# EAGLE design classix (EAGLE 6.1)

## Sheet 1 of 2
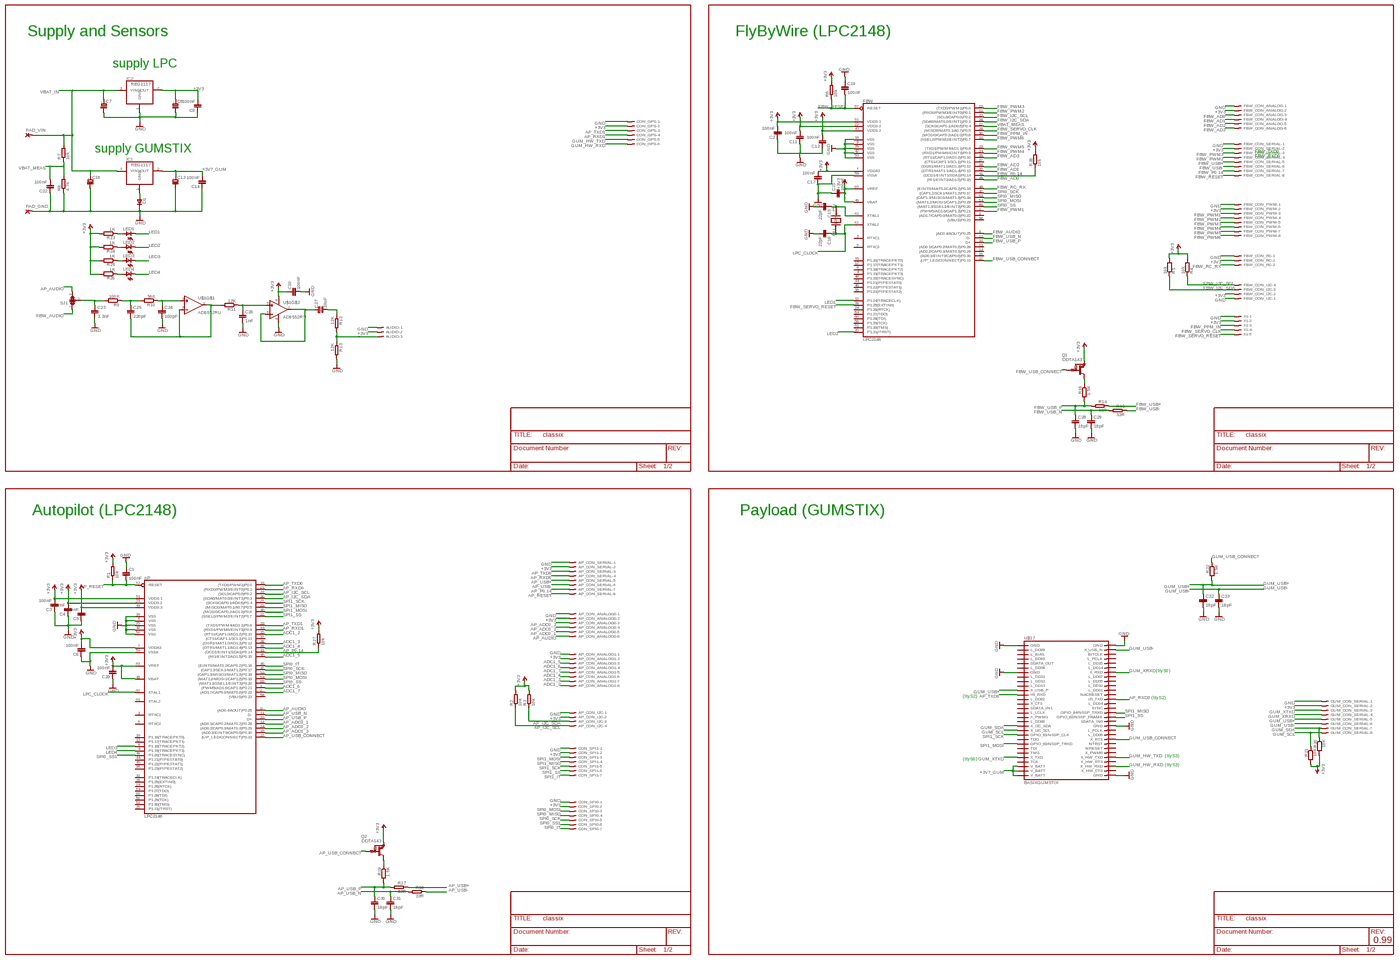
[diagram p0: schematic, sheet 1, overview]
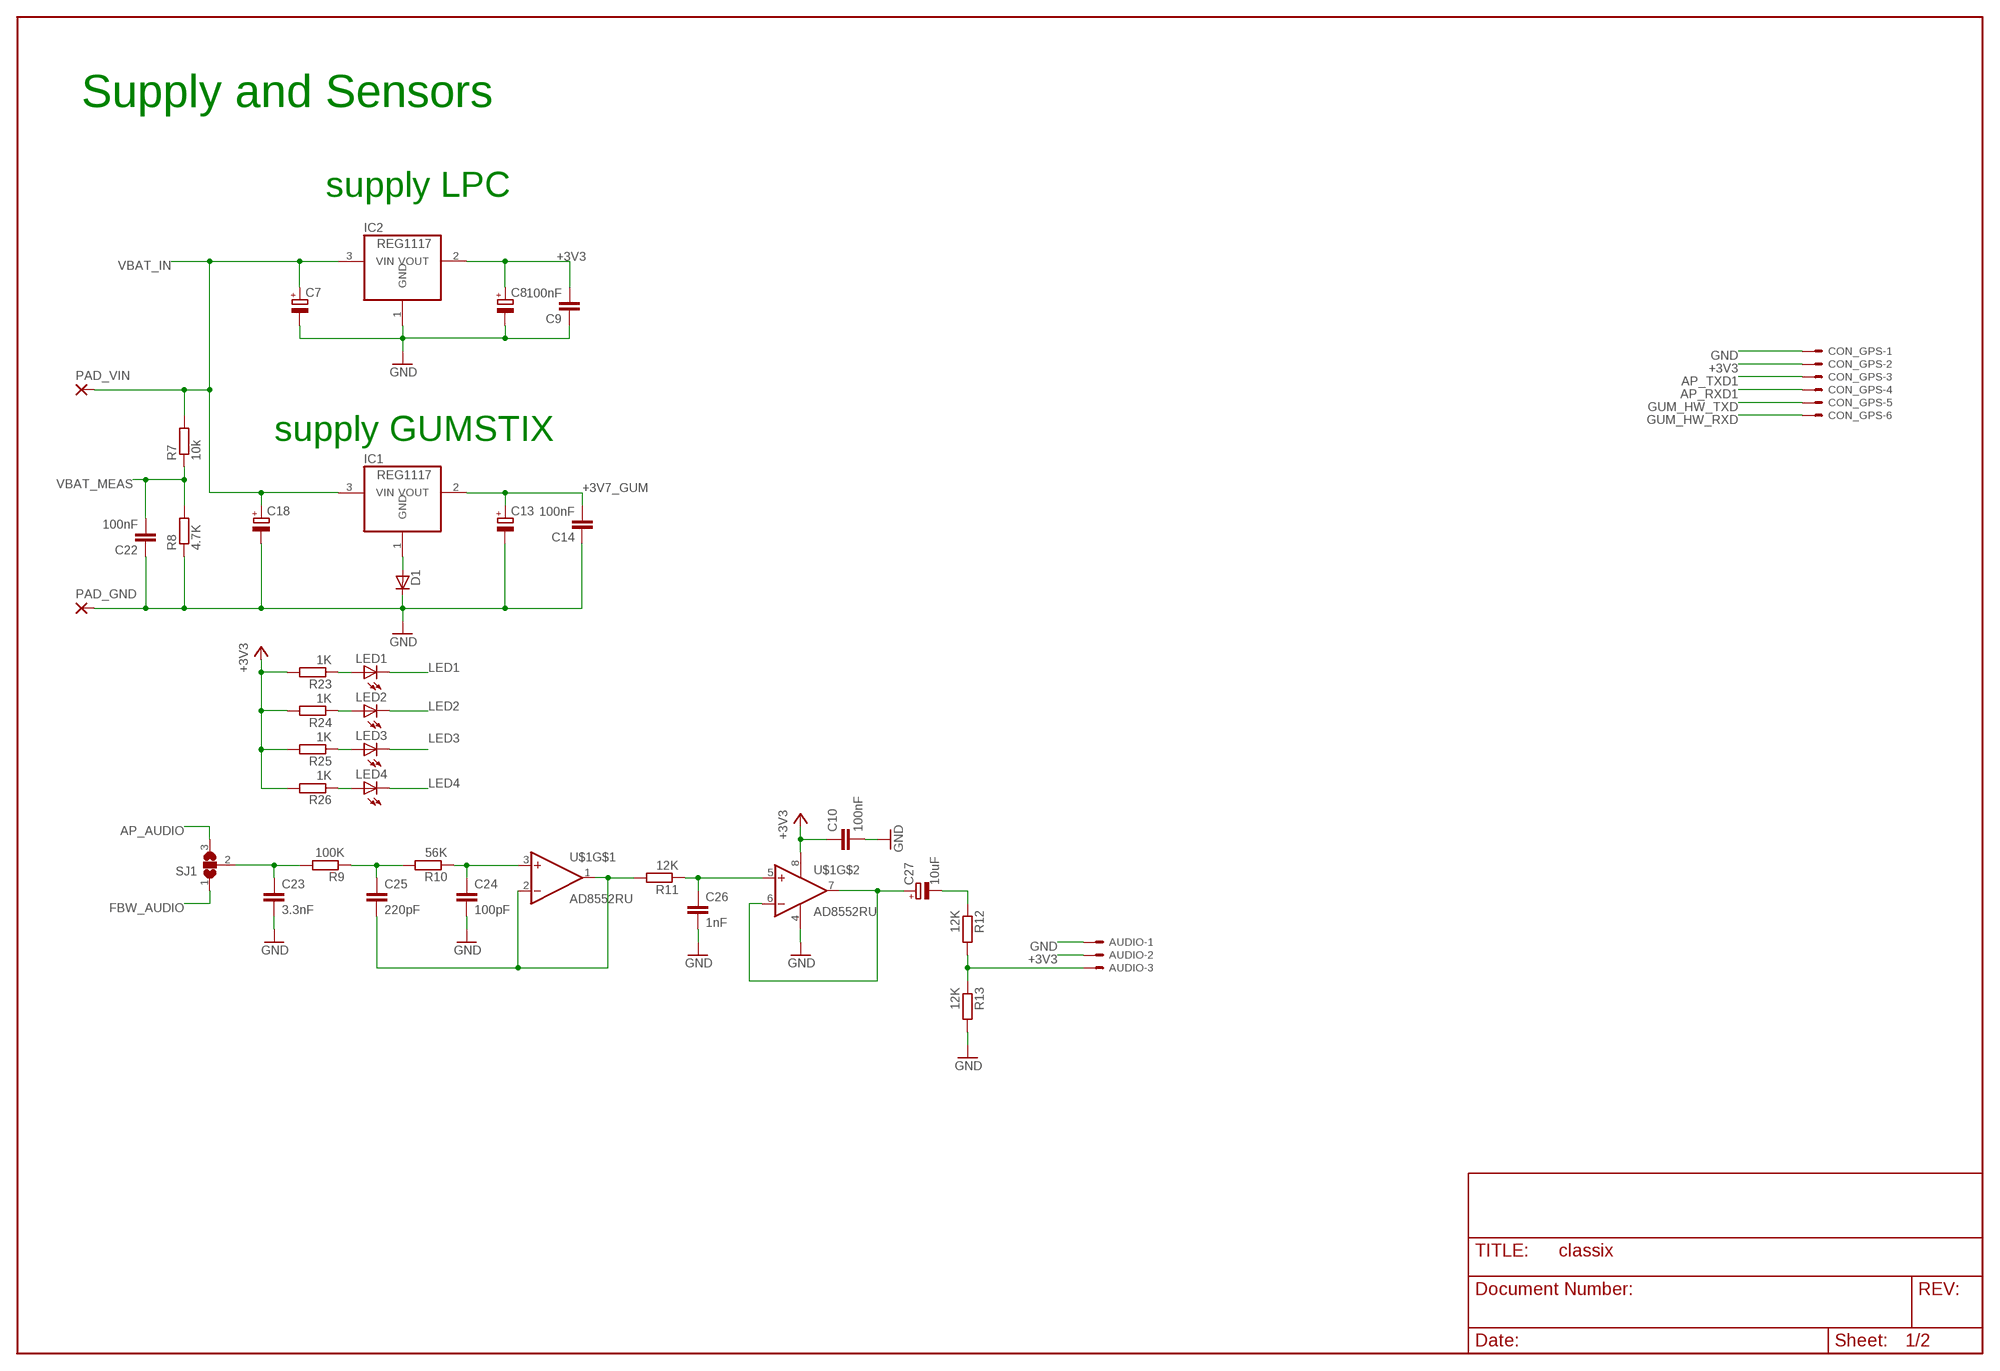
[diagram p1: schematic, sheet 1, part 1 of 4]
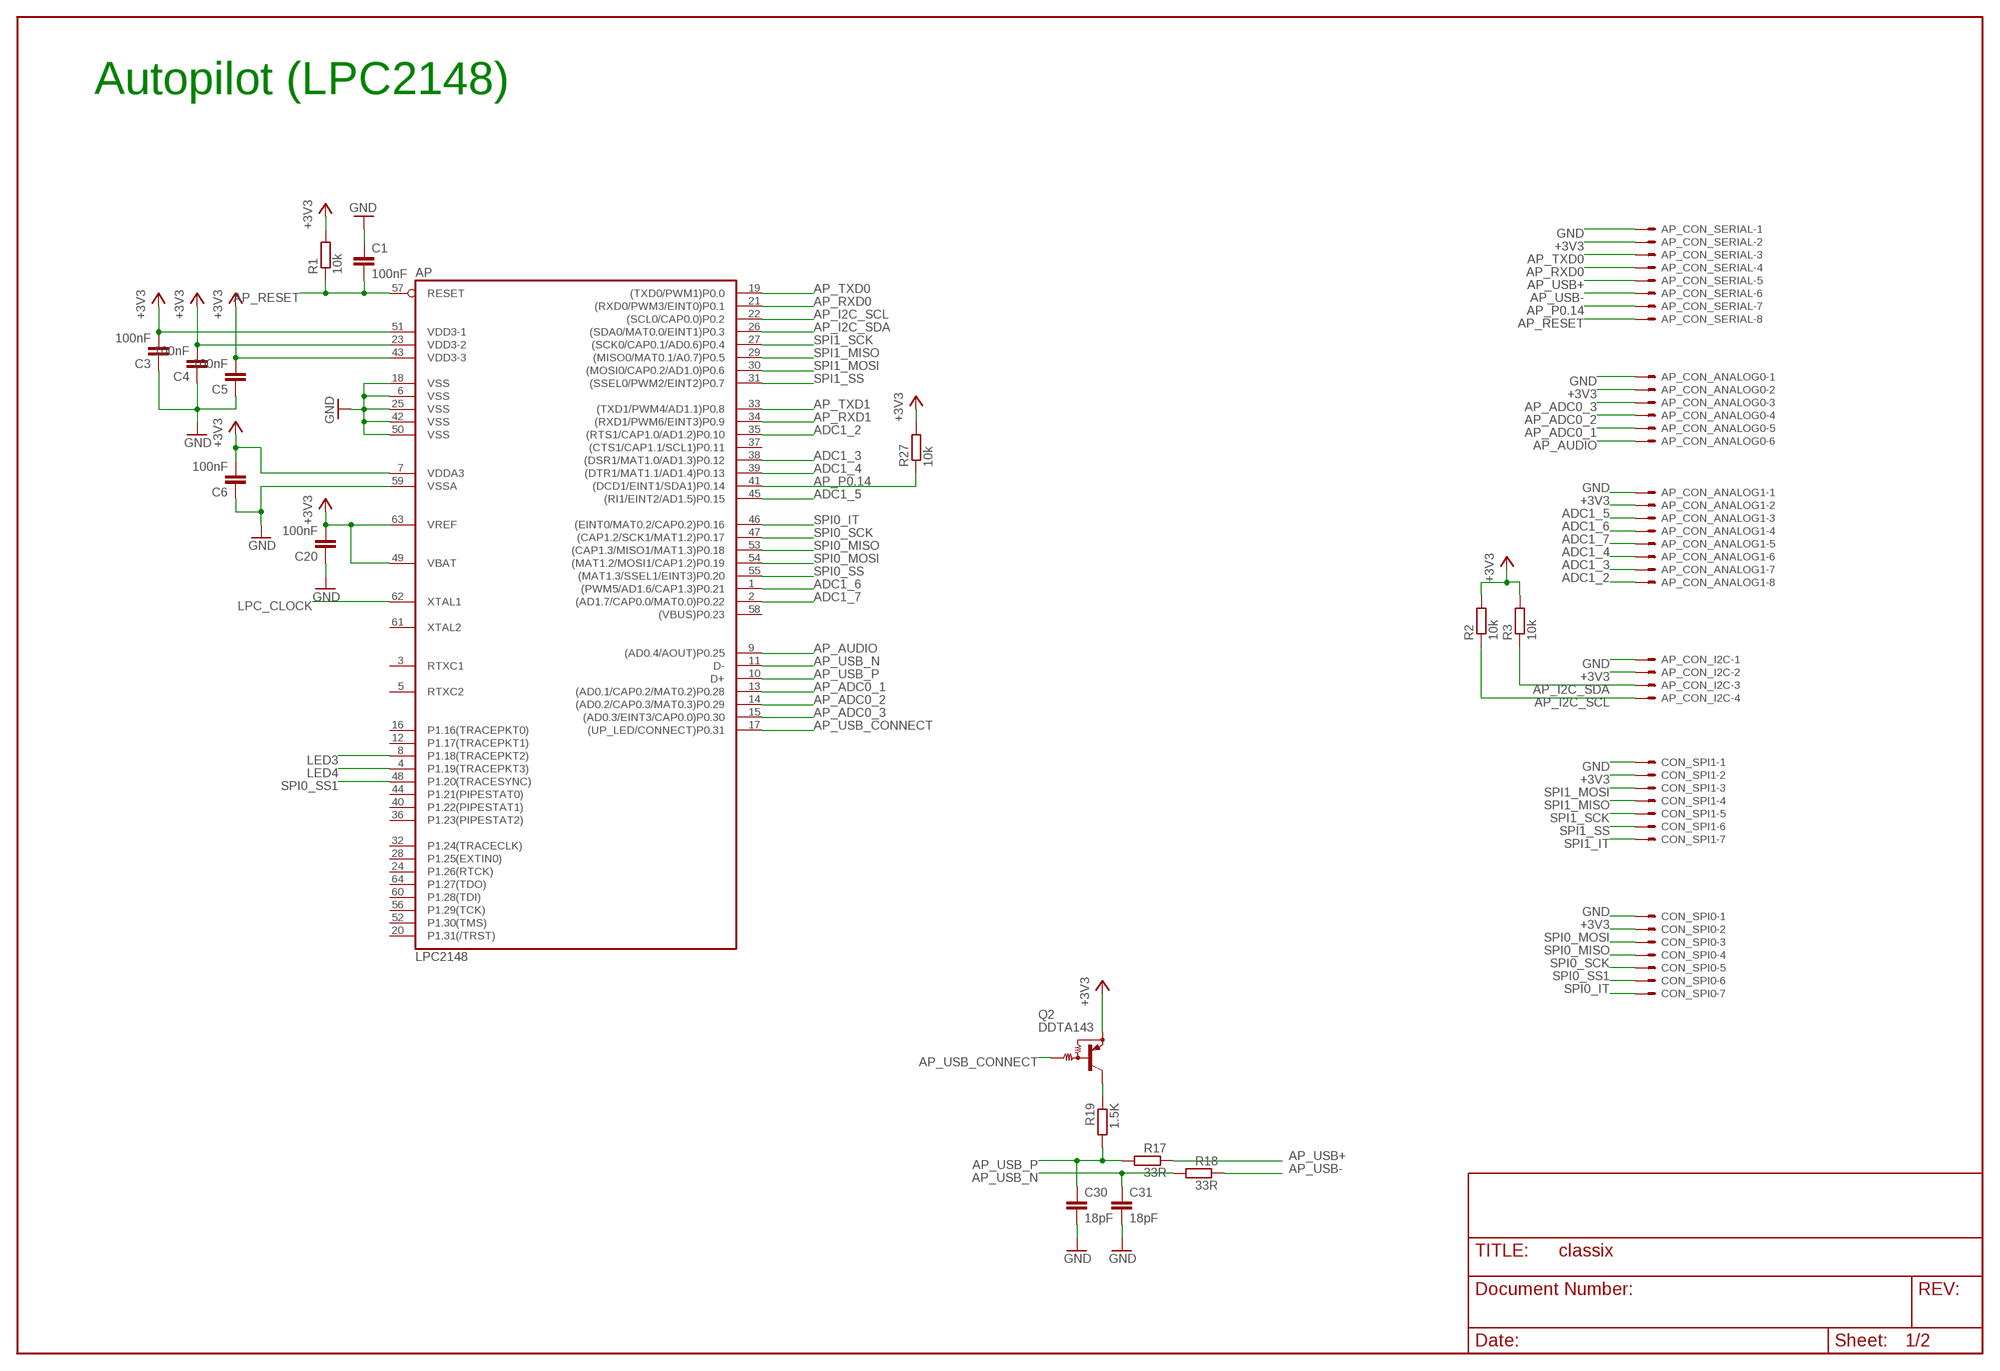
[diagram p2: schematic, sheet 1, part 2 of 4]
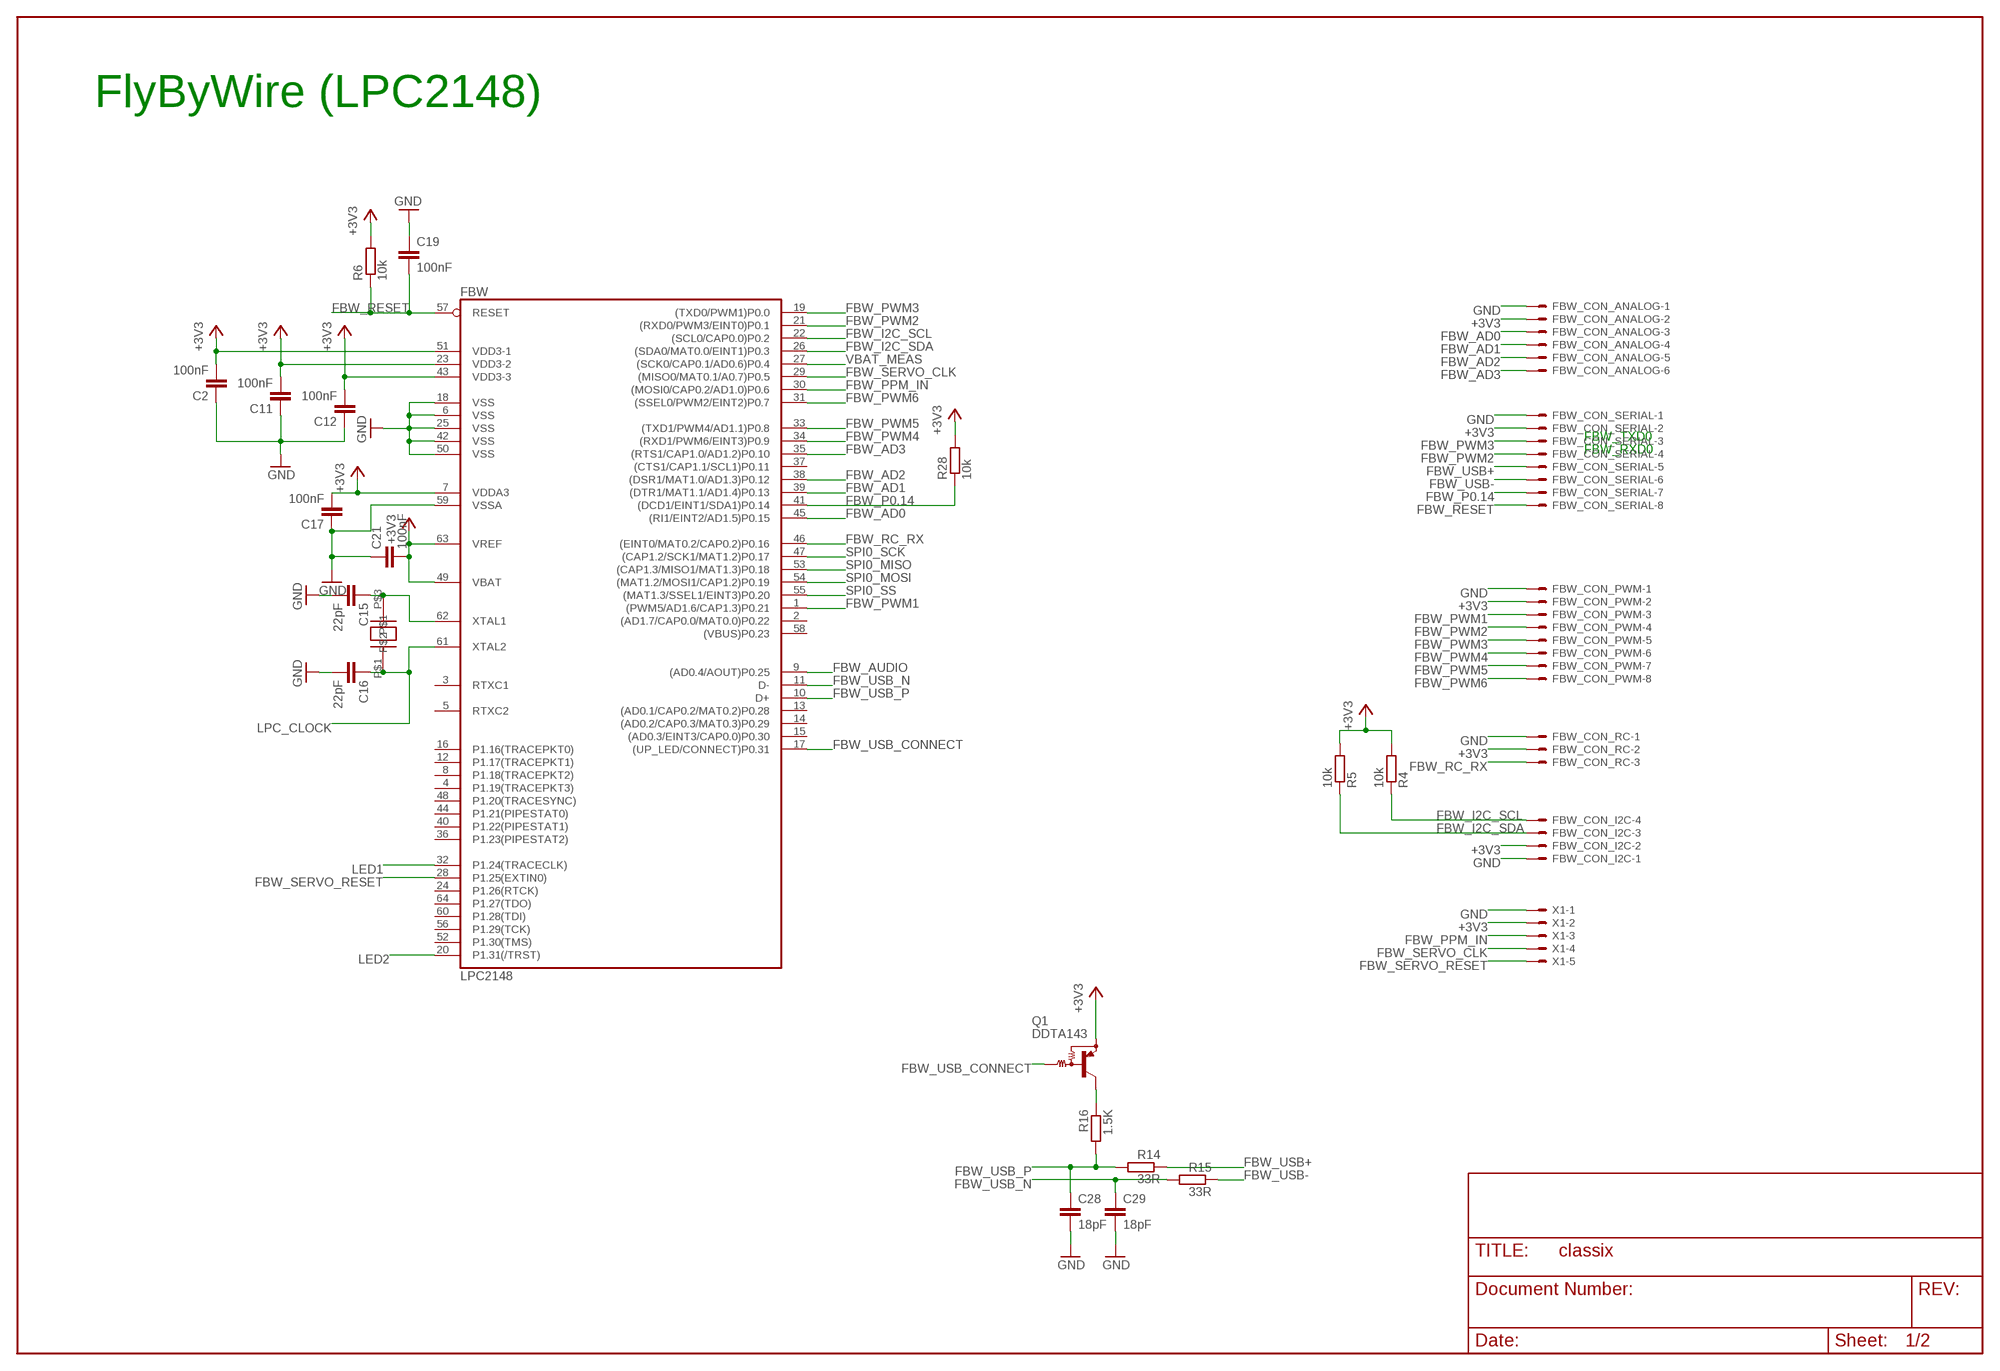
[diagram p3: schematic, sheet 1, part 3 of 4]
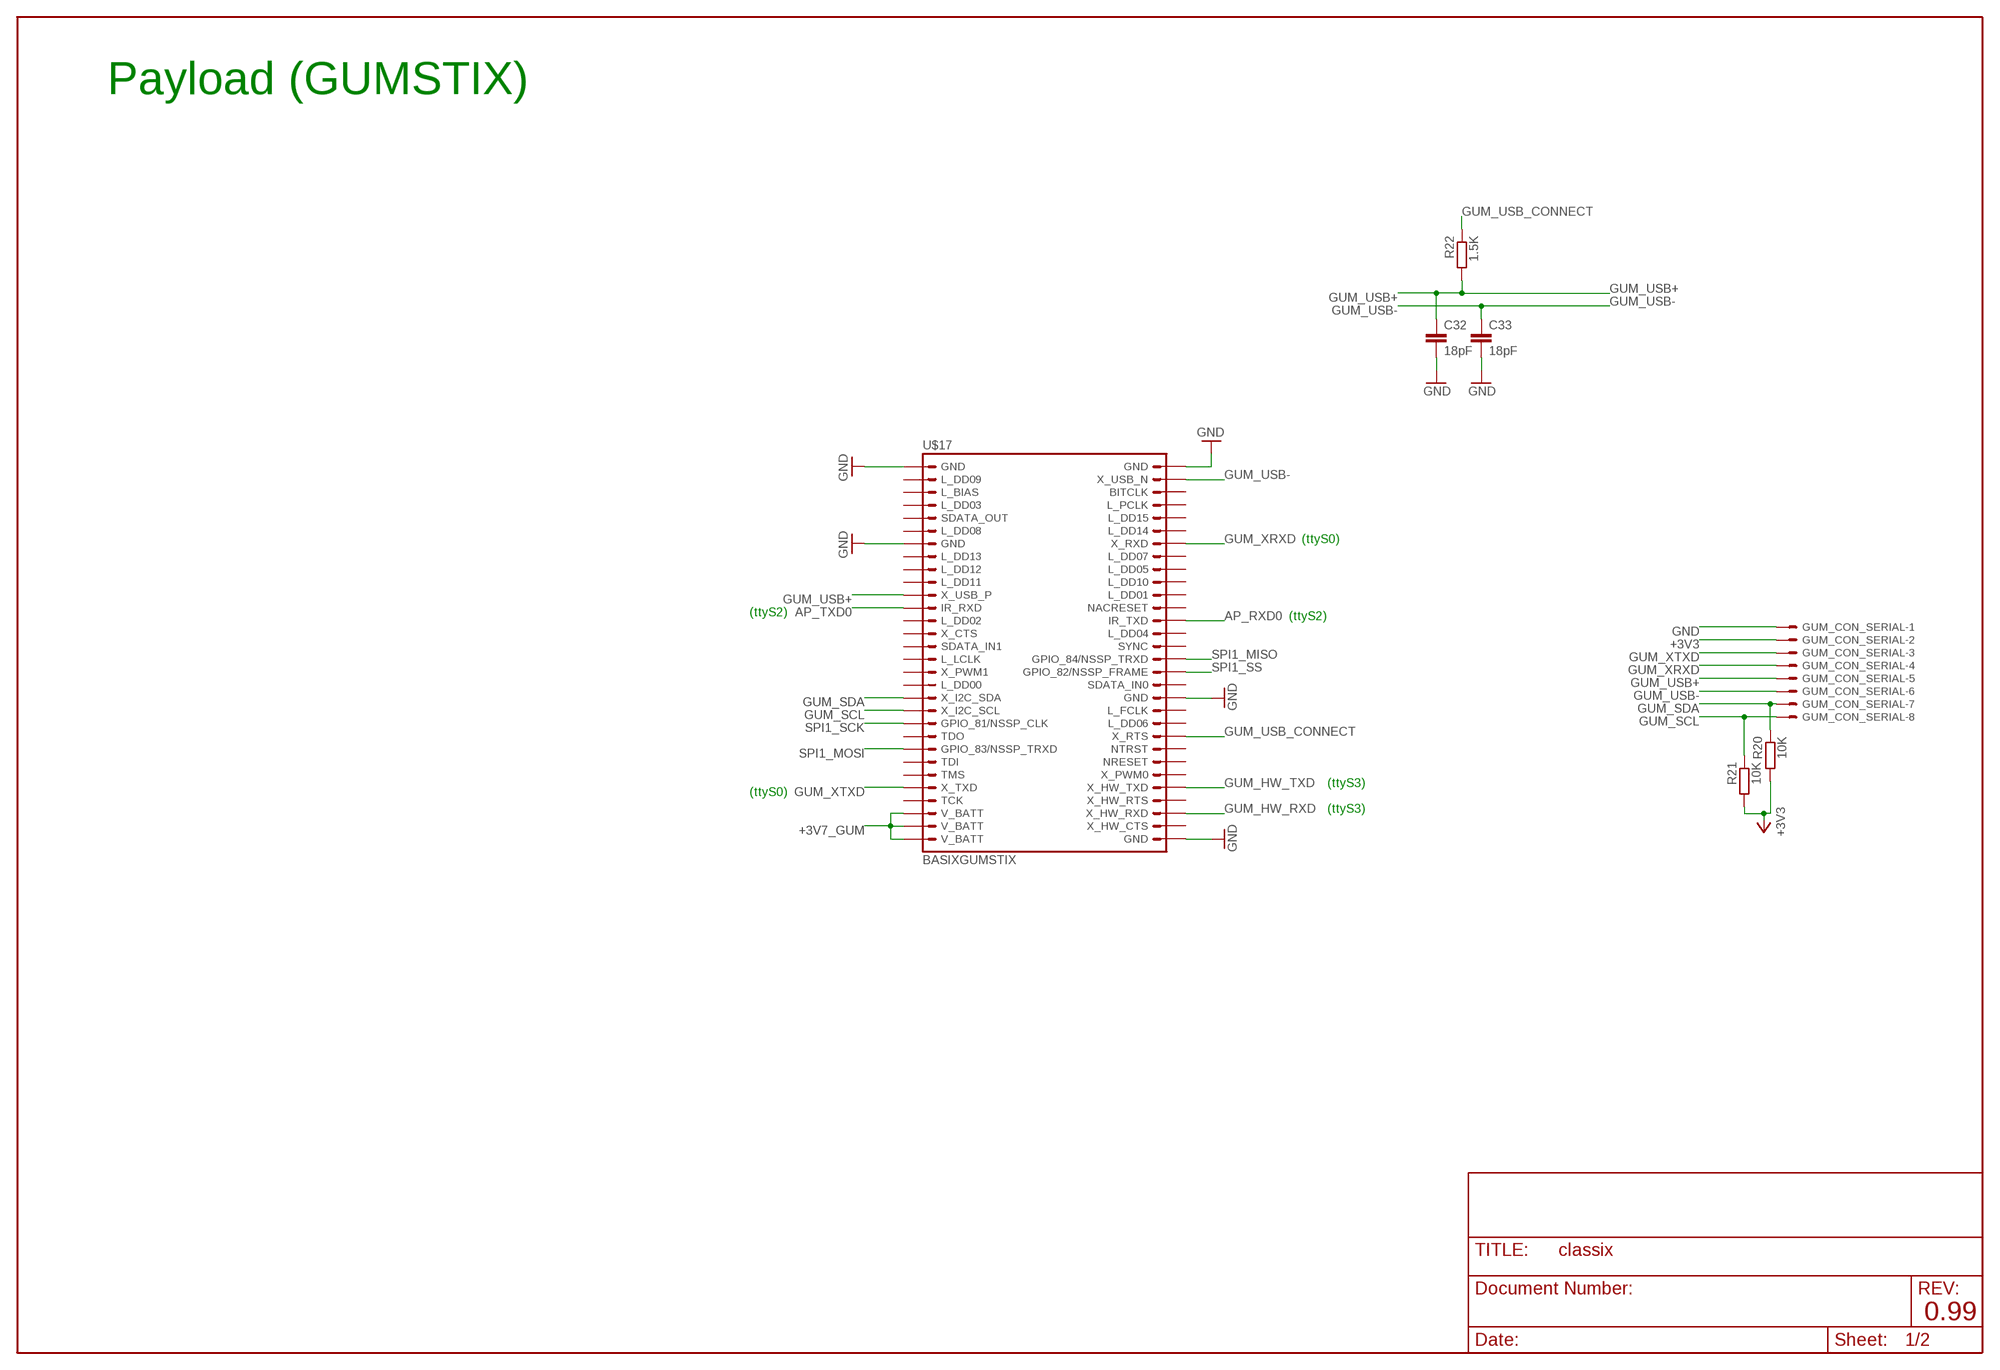
[diagram p4: schematic, sheet 1, part 4 of 4]

### Parts
AP  LPC2148  [SQFP-S-10X10-64]
AP_CON_ANALOG0  53047-06  [53047-06]
AP_CON_ANALOG1  53047-08  [53047-08]
AP_CON_I2C  53047-04  [53047-04]
AP_CON_SERIAL  53047-08  [53047-08]
AUDIO  53047-03  [53047-03]
C1  100nF  C-EUC0603  [C0603]
C2  100nF  C-EUC0603  [C0603]
C3  100nF  C-EUC0603  [C0603]
C4  100nF  C-EUC0603  [C0603]
C5  100nF  C-EUC0603  [C0603]
C6  100nF  C-EUC0603  [C0603]
C7  CPOL-EUA/3216-18R  [A/3216-18R]
C8  CPOL-EUB/3528-21R  [B/3528-21R]
C9  100nF  C-EUC0603  [C0603]
C10  100nF  C-EUC0603  [C0603]
C11  100nF  C-EUC0603  [C0603]
C12  100nF  C-EUC0603  [C0603]
C13  CPOL-EUB/3528-21R  [B/3528-21R]
C14  100nF  C-EUC0603  [C0603]
C15  22pF  C-EUC0603  [C0603]
C16  22pF  C-EUC0603  [C0603]
C17  100nF  C-EUC0603  [C0603]
C18  CPOL-EUA/3216-18R  [A/3216-18R]
C19  100nF  C-EUC0603  [C0603]
C20  100nF  C-EUC0603  [C0603]
C21  100nF  C-EUC0603  [C0603]
C22  100nF  C-EUC0603  [C0603]
C23  3.3nF  C-EUC0603  [C0603]
C24  100pF  C-EUC0603  [C0603]
C25  220pF  C-EUC0603  [C0603]
C26  1nF  C-EUC0603  [C0603]
C27  10uF  CPOL-EUA/3216-18R  [A/3216-18R]
C28  18pF  C-EUC0603  [C0603]
C29  18pF  C-EUC0603  [C0603]
C30  18pF  C-EUC0603  [C0603]
C31  18pF  C-EUC0603  [C0603]
C32  18pF  C-EUC0603  [C0603]
C33  18pF  C-EUC0603  [C0603]
CON_GPS  53047-06  [53047-06]
CON_SPI0  53047-07  [53047-07]
CON_SPI1  53047-07  [53047-07]
D1  D-SOD-80  [SOD80]
FBW  LPC2148  [SQFP-S-10X10-64]
FBW_CON_ANALOG  53047-06  [53047-06]
FBW_CON_I2C  53047-04  [53047-04]
FBW_CON_PWM  53047-08  [53047-08]
FBW_CON_RC  53047-03  [53047-03]
FBW_CON_SERIAL  53047-08  [53047-08]
GUM_CON_SERIAL  53047-08  [53047-08]
IC1  REG1117  [SOT223]
IC2  REG1117  [SOT223]
LED1  LEDCHIP-LED0805  [CHIP-LED0805]
LED2  LEDCHIP-LED0805  [CHIP-LED0805]
LED3  LEDCHIP-LED0805  [CHIP-LED0805]
LED4  LEDCHIP-LED0805  [CHIP-LED0805]
PAD_GND  SMD5  [SMD5]
PAD_VIN  SMD5  [SMD5]
Q1  DDTA143  MUN2111T1  [SC59-BEC]
Q2  DDTA143  MUN2111T1  [SC59-BEC]
R1  10k  R-EU_R0603  [R0603]
R2  10k  R-EU_R0603  [R0603]
R3  10k  R-EU_R0603  [R0603]
R4  10k  R-EU_R0603  [R0603]
R5  10k  R-EU_R0603  [R0603]
R6  10k  R-EU_R0603  [R0603]
R7  10k  R-EU_R0603  [R0603]
R8  4.7K  R-EU_R0603  [R0603]
R9  100K  R-EU_R0603  [R0603]
R10  56K  R-EU_R0603  [R0603]
R11  12K  R-EU_R0603  [R0603]
R12  12K  R-EU_R0603  [R0603]
R13  12K  R-EU_R0603  [R0603]
R14  33R  R-EU_R0603  [R0603]
R15  33R  R-EU_R0603  [R0603]
R16  1.5K  R-EU_R0603  [R0603]
R17  33R  R-EU_R0603  [R0603]
R18  33R  R-EU_R0603  [R0603]
R19  1.5K  R-EU_R0603  [R0603]
R20  10K  R-EU_R0603  [R0603]
R21  10K  R-EU_R0603  [R0603]
R22  1.5K  R-EU_R0603  [R0603]
R23  1K  R-EU_R0603  [R0603]
R24  1K  R-EU_R0603  [R0603]
R25  1K  R-EU_R0603  [R0603]
R26  1K  R-EU_R0603  [R0603]
R27  10k  R-EU_R0603  [R0603]
R28  10k  R-EU_R0603  [R0603]
SJ1  SJ2W  [SJ_2]
U$1  AD8552RU  [TSSOP8]
U$17  BASIXGUMSTIX  [GUMDF12]
U$20  CRYSTAL_CTS  [CTS_CRYSTAL]
X1  53047-05  [53047-05]

### Nets
+3V3: AP.7(VDDA3) AP.23(VDD3-2) AP.43(VDD3-3) AP.49(VBAT) AP.51(VDD3-1) AP.63(VREF) AP_CON_ANALOG0.2 AP_CON_ANALOG1.2 AP_CON_I2C.2 AP_CON_SERIAL.2 AUDIO.2 C2.2 C3.2 C4.2 C5.2 C6.2 C8.+ C9.2 C10.1 C11.2 C12.2 C17.2 C20.2 C21.2 CON_GPS.2 CON_SPI0.2 CON_SPI1.2 FBW.7(VDDA3) FBW.23(VDD3-2) FBW.43(VDD3-3) FBW.49(VBAT) FBW.51(VDD3-1) FBW.63(VREF) FBW_CON_ANALOG.2 FBW_CON_I2C.2 FBW_CON_PWM.2 FBW_CON_RC.2 FBW_CON_SERIAL.2 GUM_CON_SERIAL.2 IC2.2(VOUT) Q1.E Q2.E R1.2 R2.2 R3.2 R4.2 R5.2 R6.2 R20.2 R21.2 R23.2 R24.2 R25.2 R26.2 R27.2 R28.2 U$1.8(V+) X1.2
+3V7_GUM: C13.+ C14.2 IC1.2(VOUT) U$17.28(V_BATT) U$17.29(V_BATT) U$17.30(V_BATT)
ADC1_2: AP.35((RTS1/CAP1.0/AD1.2)P0.10) AP_CON_ANALOG1.8
ADC1_3: AP.38((DSR1/MAT1.0/AD1.3)P0.12) AP_CON_ANALOG1.7
ADC1_4: AP.39((DTR1/MAT1.1/AD1.4)P0.13) AP_CON_ANALOG1.6
ADC1_5: AP.45((RI1/EINT2/AD1.5)P0.15) AP_CON_ANALOG1.3
ADC1_6: AP.1((PWM5/AD1.6/CAP1.3)P0.21) AP_CON_ANALOG1.4
ADC1_7: AP.2((AD1.7/CAP0.0/MAT0.0)P0.22) AP_CON_ANALOG1.5
AP_ADC0_1: AP.13((AD0.1/CAP0.2/MAT0.2)P0.28) AP_CON_ANALOG0.5
AP_ADC0_2: AP.14((AD0.2/CAP0.3/MAT0.3)P0.29) AP_CON_ANALOG0.4
AP_ADC0_3: AP.15((AD0.3/EINT3/CAP0.0)P0.30) AP_CON_ANALOG0.3
AP_AUDIO: AP.9((AD0.4/AOUT)P0.25) AP_CON_ANALOG0.6 SJ1.3
AP_I2C_SCL: AP.22((SCL0/CAP0.0)P0.2) AP_CON_I2C.4 R2.1
AP_I2C_SDA: AP.26((SDA0/MAT0.0/EINT1)P0.3) AP_CON_I2C.3 R3.1
AP_P0.14: AP.41((DCD1/EINT1/SDA1)P0.14) AP_CON_SERIAL.7 R27.1
AP_RESET: AP.57(RESET) AP_CON_SERIAL.8 C1.2 R1.1
AP_RXD0: AP.21((RXD0/PWM3/EINT0)P0.1) AP_CON_SERIAL.4 U$17.48(IR_TXD)
AP_RXD1: AP.34((RXD1/PWM6/EINT3)P0.9) CON_GPS.4
AP_TXD0: AP.19((TXD0/PWM1)P0.0) AP_CON_SERIAL.3 U$17.12(IR_RXD)
AP_TXD1: AP.33((TXD1/PWM4/AD1.1)P0.8) CON_GPS.3
AP_USB+: AP_CON_SERIAL.5 R17.1
AP_USB-: AP_CON_SERIAL.6 R18.1
AP_USB_CONNECT: AP.17((UP_LED/CONNECT)P0.31) Q2.B
AP_USB_N: AP.11(D-) C31.1 R18.2
AP_USB_P: AP.10(D+) C30.1 R17.2 R19.2
FBW_AD0: FBW.45((RI1/EINT2/AD1.5)P0.15) FBW_CON_ANALOG.3
FBW_AD1: FBW.39((DTR1/MAT1.1/AD1.4)P0.13) FBW_CON_ANALOG.4
FBW_AD2: FBW.38((DSR1/MAT1.0/AD1.3)P0.12) FBW_CON_ANALOG.5
FBW_AD3: FBW.35((RTS1/CAP1.0/AD1.2)P0.10) FBW_CON_ANALOG.6
FBW_AUDIO: FBW.9((AD0.4/AOUT)P0.25) SJ1.1
FBW_I2C_SCL: FBW.22((SCL0/CAP0.0)P0.2) FBW_CON_I2C.4 R4.1
FBW_I2C_SDA: FBW.26((SDA0/MAT0.0/EINT1)P0.3) FBW_CON_I2C.3 R5.1
FBW_P0.14: FBW.41((DCD1/EINT1/SDA1)P0.14) FBW_CON_SERIAL.7 R28.1
FBW_PPM_IN: FBW.30((MOSI0/CAP0.2/AD1.0)P0.6) X1.3
FBW_PWM1: FBW.1((PWM5/AD1.6/CAP1.3)P0.21) FBW_CON_PWM.3
FBW_PWM2: FBW.21((RXD0/PWM3/EINT0)P0.1) FBW_CON_PWM.4 FBW_CON_SERIAL.4
FBW_PWM3: FBW.19((TXD0/PWM1)P0.0) FBW_CON_PWM.5 FBW_CON_SERIAL.3
FBW_PWM4: FBW.34((RXD1/PWM6/EINT3)P0.9) FBW_CON_PWM.6
FBW_PWM5: FBW.33((TXD1/PWM4/AD1.1)P0.8) FBW_CON_PWM.7
FBW_PWM6: FBW.31((SSEL0/PWM2/EINT2)P0.7) FBW_CON_PWM.8
FBW_RC_RX: FBW.46((EINT0/MAT0.2/CAP0.2)P0.16) FBW_CON_RC.3
FBW_RESET: C19.2 FBW.57(RESET) FBW_CON_SERIAL.8 R6.1
FBW_SERVO_CLK: FBW.29((MISO0/MAT0.1/A0.7)P0.5) X1.4
FBW_SERVO_RESET: FBW.28(P1.25(EXTIN0)) X1.5
FBW_USB+: FBW_CON_SERIAL.5 R14.1
FBW_USB-: FBW_CON_SERIAL.6 R15.1
FBW_USB_CONNECT: FBW.17((UP_LED/CONNECT)P0.31) Q1.B
FBW_USB_N: C29.1 FBW.11(D-) R15.2
FBW_USB_P: C28.1 FBW.10(D+) R14.2 R16.2
FOO_BAR: C23.1 R9.2 SJ1.2
GND: AP.6(VSS) AP.18(VSS) AP.25(VSS) AP.42(VSS) AP.50(VSS) AP.59(VSSA) AP_CON_ANALOG0.1 AP_CON_ANALOG1.1 AP_CON_I2C.1 AP_CON_SERIAL.1 AUDIO.1 C1.1 C2.1 C3.1 C4.1 C5.1 C6.1 C7.- C8.- C9.1 C10.2 C11.1 C12.1 C13.- C14.1 C15.2 C16.2 C17.1 C18.- C19.1 C20.1 C21.1 C22.1 C23.2 C24.2 C26.2 C28.2 C29.2 C30.2 C31.2 C32.2 C33.2 CON_GPS.1 CON_SPI0.1 CON_SPI1.1 D1.1(C) FBW.6(VSS) FBW.18(VSS) FBW.25(VSS) FBW.42(VSS) FBW.50(VSS) FBW.59(VSSA) FBW_CON_ANALOG.1 FBW_CON_I2C.1 FBW_CON_PWM.1 FBW_CON_RC.1 FBW_CON_SERIAL.1 GUM_CON_SERIAL.1 IC2.1(GND) PAD_GND.1(P) R8.1 R13.2 U$1.4(V-) U$17.1(GND) U$17.7(GND) U$17.31(GND) U$17.42(GND) U$17.60(GND) X1.1
GUM_HW_RXD: CON_GPS.6 U$17.33(X_HW_RXD)
GUM_HW_TXD: CON_GPS.5 U$17.35(X_HW_TXD)
GUM_SCL: GUM_CON_SERIAL.8 R21.1 U$17.20(X_I2C_SCL)
GUM_SDA: GUM_CON_SERIAL.7 R20.1 U$17.19(X_I2C_SDA)
GUM_USB+: C32.1 GUM_CON_SERIAL.5 R22.2 U$17.11(X_USB_P)
GUM_USB-: C33.1 GUM_CON_SERIAL.6 U$17.59(X_USB_N)
GUM_USB_CONNECT: R22.1 U$17.39(X_RTS)
GUM_XRXD: GUM_CON_SERIAL.4 U$17.54(X_RXD)
GUM_XTXD: GUM_CON_SERIAL.3 U$17.26(X_TXD)
LED1: FBW.32(P1.24(TRACECLK)) LED1.C
LED2: FBW.20(P1.31(/TRST)) LED2.C
LED3: AP.8(P1.18(TRACEPKT2)) LED3.C
LED4: AP.4(P1.19(TRACEPKT3)) LED4.C
LPC_CLOCK: AP.62(XTAL1) C16.1 FBW.61(XTAL2) U$20.P$1
N$1: C15.1 FBW.62(XTAL1) U$20.P$3
N$2: D1.2(A) IC1.1(GND)
N$3: LED4.A R26.1
N$4: LED1.A R23.1
N$5: LED2.A R24.1
N$6: LED3.A R25.1
N$13: C25.1 R9.1 R10.2
N$15: C24.1 R10.1 U$1.3(+IN)
N$17: C25.2 R11.2 U$1.1(OUT) U$1.2(-IN)
N$18: C26.1 R11.1 U$1.5(+IN)
N$19: C27.+ U$1.6(-IN) U$1.7(OUT)
N$20: C27.- R12.1
N$21: AUDIO.3 R12.2 R13.1
N$24: Q1.C R16.1
N$27: Q2.C R19.1
SPI0_IT: AP.46((EINT0/MAT0.2/CAP0.2)P0.16) CON_SPI0.7
SPI0_MISO: AP.53((CAP1.3/MISO1/MAT1.3)P0.18) CON_SPI0.4 FBW.53((CAP1.3/MISO1/MAT1.3)P0.18)
SPI0_MOSI: AP.54((MAT1.2/MOSI1/CAP1.2)P0.19) CON_SPI0.3 FBW.54((MAT1.2/MOSI1/CAP1.2)P0.19)
SPI0_SCK: AP.47((CAP1.2/SCK1/MAT1.2)P0.17) CON_SPI0.5 FBW.47((CAP1.2/SCK1/MAT1.2)P0.17)
SPI0_SS: AP.55((MAT1.3/SSEL1/EINT3)P0.20) FBW.55((MAT1.3/SSEL1/EINT3)P0.20)
SPI0_SS1: AP.48(P1.20(TRACESYNC)) CON_SPI0.6
SPI1_IT: CON_SPI1.7
SPI1_MISO: AP.29((MISO0/MAT0.1/A0.7)P0.5) CON_SPI1.4 U$17.45(GPIO_84/NSSP_TRXD)
SPI1_MOSI: AP.30((MOSI0/CAP0.2/AD1.0)P0.6) CON_SPI1.3 U$17.23(GPIO_83/NSSP_TRXD)
SPI1_SCK: AP.27((SCK0/CAP0.1/AD0.6)P0.4) CON_SPI1.5 U$17.21(GPIO_81/NSSP_CLK)
SPI1_SS: AP.31((SSEL0/PWM2/EINT2)P0.7) CON_SPI1.6 U$17.44(GPIO_82/NSSP_FRAME)
VBAT_IN: C7.+ C18.+ IC1.3(VIN) IC2.3(VIN) PAD_VIN.1(P) R7.2
VBAT_MEAS: C22.2 FBW.27((SCK0/CAP0.1/AD0.6)P0.4) R7.1 R8.2
Unconnected: AP.3(RTXC1) AP.5(RTXC2) AP.12(P1.17(TRACEPKT1)) AP.16(P1.16(TRACEPKT0)) AP.20(P1.31(/TRST)) AP.24(P1.26(RTCK)) AP.28(P1.25(EXTIN0)) AP.32(P1.24(TRACECLK)) AP.36(P1.23(PIPESTAT2)) AP.37((CTS1/CAP1.1/SCL1)P0.11) AP.40(P1.22(PIPESTAT1)) AP.44(P1.21(PIPESTAT0)) AP.52(P1.30(TMS)) AP.56(P1.29(TCK)) AP.58((VBUS)P0.23) AP.60(P1.28(TDI)) AP.61(XTAL2) AP.64(P1.27(TDO)) FBW.2((AD1.7/CAP0.0/MAT0.0)P0.22) FBW.3(RTXC1) FBW.4(P1.19(TRACEPKT3)) FBW.5(RTXC2) FBW.8(P1.18(TRACEPKT2)) FBW.12(P1.17(TRACEPKT1)) FBW.13((AD0.1/CAP0.2/MAT0.2)P0.28) FBW.14((AD0.2/CAP0.3/MAT0.3)P0.29) FBW.15((AD0.3/EINT3/CAP0.0)P0.30) FBW.16(P1.16(TRACEPKT0)) FBW.24(P1.26(RTCK)) FBW.36(P1.23(PIPESTAT2)) FBW.37((CTS1/CAP1.1/SCL1)P0.11) FBW.40(P1.22(PIPESTAT1)) FBW.44(P1.21(PIPESTAT0)) FBW.48(P1.20(TRACESYNC)) FBW.52(P1.30(TMS)) FBW.56(P1.29(TCK)) FBW.58((VBUS)P0.23) FBW.60(P1.28(TDI)) FBW.64(P1.27(TDO)) U$17.2(L_DD09) U$17.3(L_BIAS) U$17.4(L_DD03) U$17.5(SDATA_OUT) U$17.6(L_DD08) U$17.8(L_DD13) U$17.9(L_DD12) U$17.10(L_DD11) U$17.13(L_DD02) U$17.14(X_CTS) U$17.15(SDATA_IN1) U$17.16(L_LCLK) U$17.17(X_PWM1) U$17.18(L_DD00) U$17.22(TDO) U$17.24(TDI) U$17.25(TMS) U$17.27(TCK) U$17.32(X_HW_CTS) U$17.34(X_HW_RTS) U$17.36(X_PWM0) U$17.37(NRESET) U$17.38(NTRST) U$17.40(L_DD06) U$17.41(L_FCLK) U$17.43(SDATA_IN0) U$17.46(SYNC) U$17.47(L_DD04) U$17.49(NACRESET) U$17.50(L_DD01) U$17.51(L_DD10) U$17.52(L_DD05) U$17.53(L_DD07) U$17.55(L_DD14) U$17.56(L_DD15) U$17.57(L_PCLK) U$17.58(BITCLK)

### Notes on the sheet
- Supply and Sensors | FlyByWire (LPC2148)
- supply LPC
- supply GUMSTIX | FBW_TXD0
- FBW_RXD0
- Autopilot (LPC2148) | Payload (GUMSTIX)
- (ttyS0)
- (ttyS2)
- (ttyS2)
- (ttyS0) | (ttyS3)
- (ttyS3)
- 0.99

## Sheet 2 of 2

## Library data of the parts
AP FBW = paparazzi:LPC2148
AP_CON_ANALOG0 CON_GPS FBW_CON_ANALOG = con-molex:53?-06: CONNECTOR wire to board 1.25 mm (.049 inch) pitch header
AP_CON_ANALOG1 AP_CON_SERIAL FBW_CON_PWM FBW_CON_SERIAL GUM_CON_SERIAL = con-molex:53?-08: CONNECTOR wire to board 1.25 mm (.049 inch) pitch header
AP_CON_I2C FBW_CON_I2C = con-molex:53?-04: CONNECTOR wire to board 1.25 mm (.049 inch) pitch header
AUDIO FBW_CON_RC = con-molex:53?-03: CONNECTOR wire to board 1.25 mm (.049 inch) pitch header
C1-C6 C9-C12 C14-C17 C19-C26 C28-C33 = rcl:C-EU: CAPACITOR, European symbol
C7 C8 C13 C18 C27 = rcl:CPOL-EU: POLARIZED CAPACITOR, European symbol
CON_SPI0 CON_SPI1 = con-molex:53?-07: CONNECTOR wire to board 1.25 mm (.049 inch) pitch header
D1 = semicon-smd-ipc:D-: DIODE unfilled
IC1 IC2 = burr-brown:REG1117: 800mA and 1A Low Dropout (LDO) Positive Regulator 1.8V, 2.5V, 2.85V, 3.3V, 5V, and Adj
LED1-LED4 = led:LED: LED OSRAM: - CHIPLED LG R971, LG N971, LY N971, LG Q971, LY Q971, LO R971, LY R971 LH N974, LH R974 LS Q976, LO Q976, LY Q976 LO Q996 - Hyper CHIPLED LW Q18S LB Q993, LB Q99A, LB R99A - SideLED LS A670, LO A670, LY A670, LG A670, LP A670 LB A673, LV A673, LT A673, LW A673 LH A674 LY A675 LS A676, LA A676, LO A676, LY A676, LW A676 LS A679, LY A679, LG A679 - Hyper Micro SIDELED® LS Y876, LA Y876, LO Y876, LY Y876 LT Y87S - SmartLED LW L88C, LW L88S LB L89C, LB L89S, LG L890 LS L89K, LO L89K, LY L89K LS L896, LA L896, LO L896, LY L896 - TOPLED LS T670, LO T670, LY T670, LG T670, LP T670 LSG T670, LSP T670, LSY T670, LOP T670, LYG T670 LG T671, LOG T671, LSG T671 LB T673, LV T673, LT T673, LW T673 LH T674 LS T676, LA T676, LO T676, LY T676, LB T676, LH T676, LSB T676, LW T676 LB T67C, LV T67C, LT T67C, LS T67K, LO T67K, LY T67K, LW E67C LS E67B, LA E67B, LO E67B, LY E67B, LB E67C, LV E67C, LT E67C LW T67C LS T679, LY T679, LG T679 LS T770, LO T770, LY T770, LG T770, LP T770 LB T773, LV T773, LT T773, LW T773 LH T774 LS E675, LA E675, LY E675, LS T675 LS T776, LA T776, LO T776, LY T776, LB T776 LHGB T686 LT T68C, LB T68C - Hyper Mini TOPLED® LB M676 - Mini TOPLED Santana® LG M470 LS M47K, LO M47K, LY M47K Source: http://www.osram.convergy.de/
PAD_GND PAD_VIN = wirepad:SMD5: SMD PAD
Q1 Q2 = transistor-pnp:MUN2111*: PNP Bias Resistor Transistor
R1-R28 = rcl:R-EU_: RESISTOR, European symbol
SJ1 = jumper:SJ2W: SMD solder JUMPER
U$1 = paparazzi:AD8552: dual op amp
U$17 = gumstix:BASIX: basix daughtercard The basix device is the framework for connecting a gumstix basix computer into a daughtercard. Two footprints are included: 1) The header connector, and 2) The header connector and an outline of the overlying gumstix including the 3 drillholes.
U$20 = paparazzi:CRYSTAL_CTS
X1 = con-molex:53?-05: CONNECTOR wire to board 1.25 mm (.049 inch) pitch header

## Board
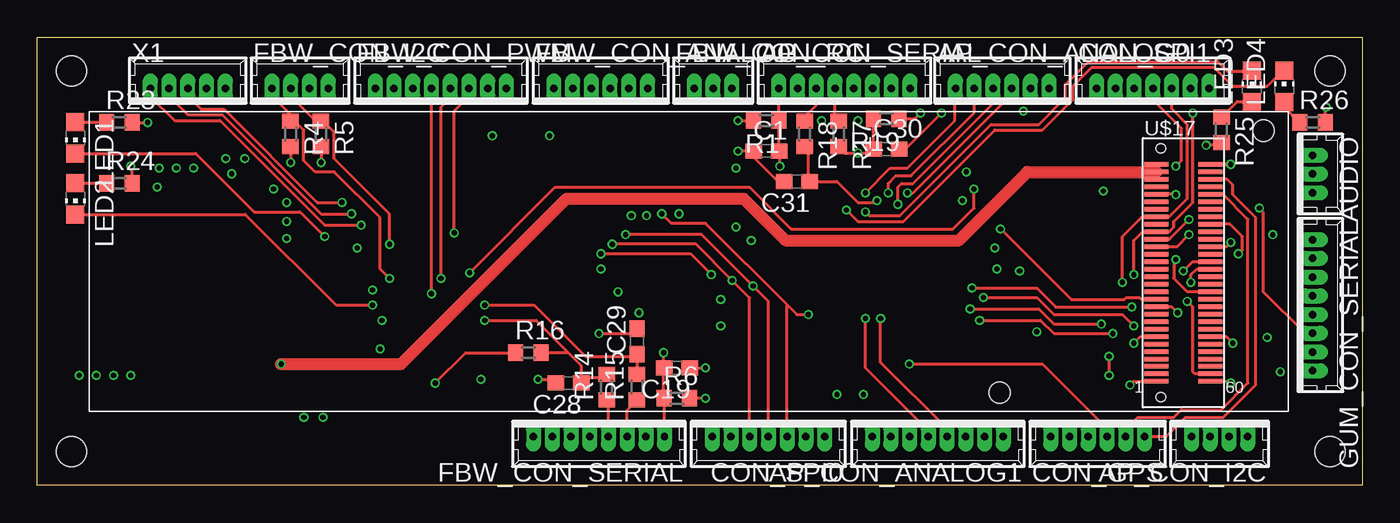
[diagram p5: board, top side]
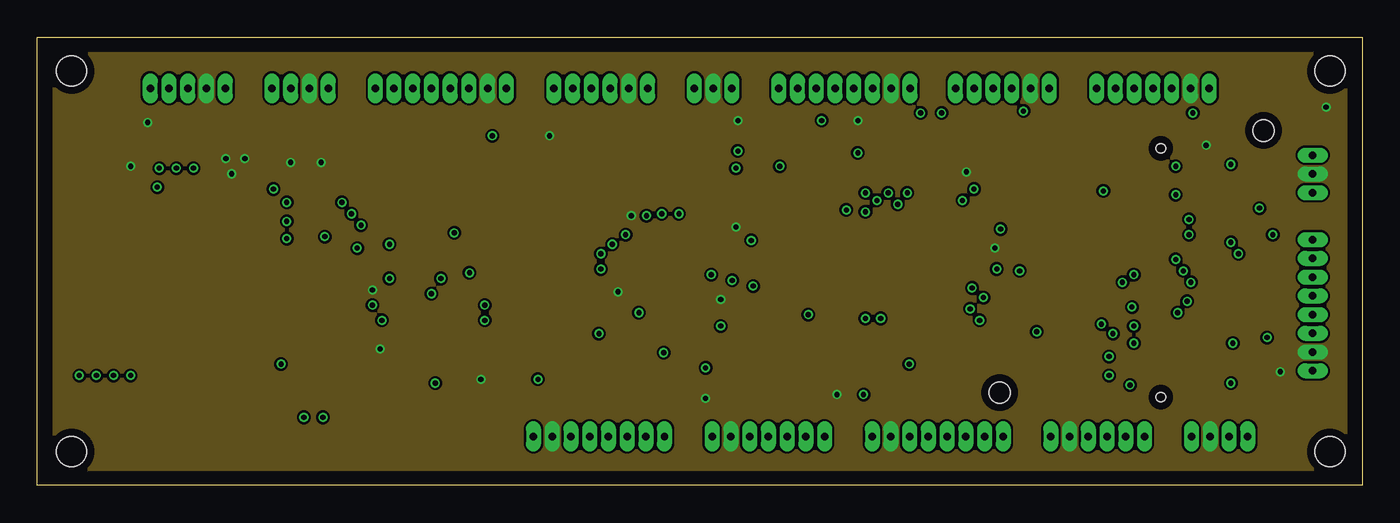
[diagram p6: board, inner layer Route2]
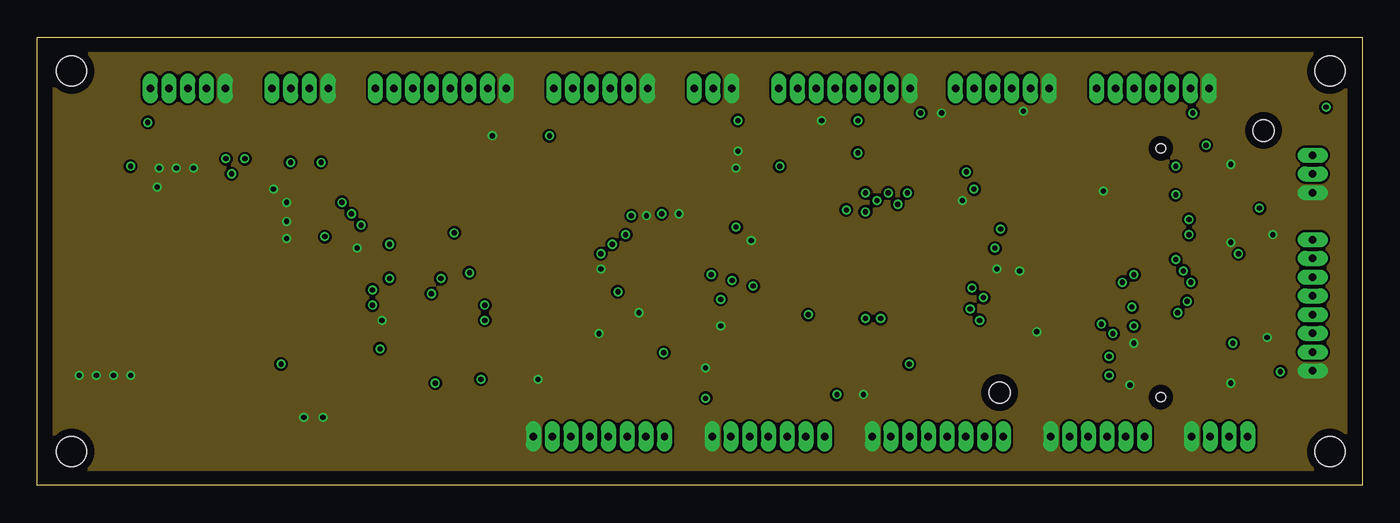
[diagram p7: board, inner layer Route15]
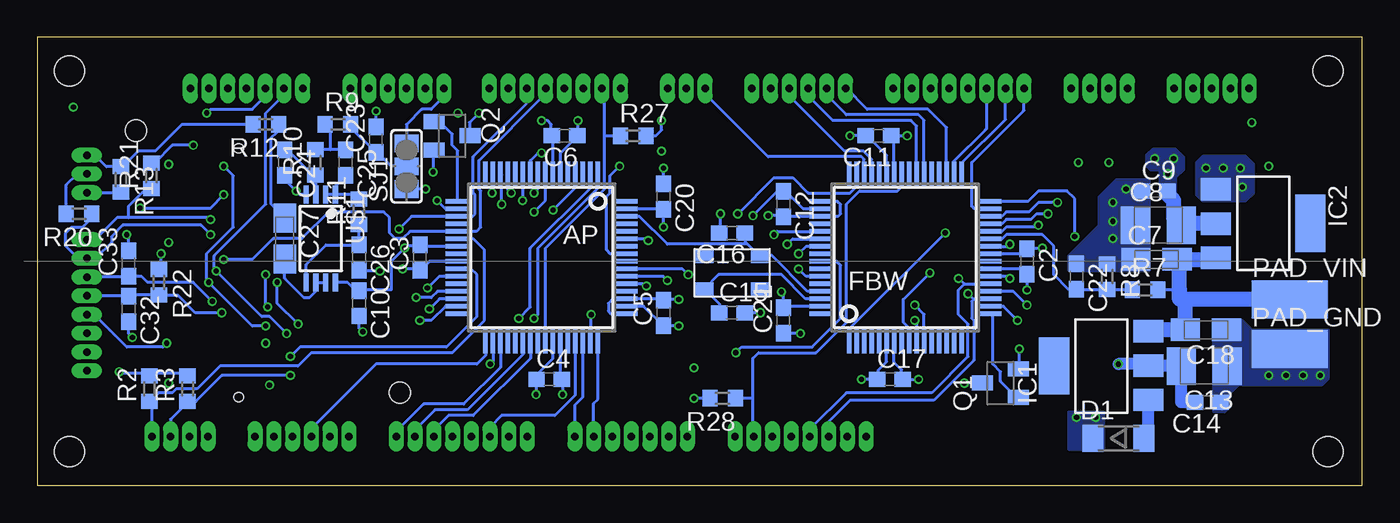
[diagram p8: board, bottom side, seen from below]

Size 88.37 x 29.9 mm. Coordinates in mm from the lower left corner, seen from the top.
Outline: 0,29.9 88.37,29.9 88.37,0 0,0 0,29.9
Copper layers ((1*2)+(15*16)): Top 0.035mm / dielectric 0.2mm / Route2 0.035mm / dielectric 1.5mm / Route15 0.035mm / dielectric 0.2mm / Bottom 0.035mm
Design rules: minimum track width 0.15mm, minimum drill 0.35mm, track to track 0.15mm, track to pad 0.15mm, pad to pad 0.15mm, via to via 0.15mm, smd to smd 0.15mm, copper to edge 20mil, drill to drill 8mil, minimum pad ring 10mil, minimum via ring 5mil, stop-mask expansion 4mil, vias tented up to drill 0mil, thermal gap 10mil
Holes 2 mm at 2.28,2.25 2.28,27.65 86.23,27.65 86.23,2.25

### Footprints (pad centres in the part's own frame; a part is rotated, then mirrored left to right if it is on the bottom)
SQFP-S-10X10-64 = smd 0.3 x 1.6: 1 -3.75,-5.6; 2 -3.25,-5.6; 3 -2.75,-5.6; 4 -2.25,-5.6; 5 -1.75,-5.6; 6 -1.25,-5.6; 7 -0.75,-5.6; 8 -0.25,-5.6; 9 0.25,-5.6; 10 0.75,-5.6; 11 1.25,-5.6; 12 1.75,-5.6; 13 2.25,-5.6; 14 2.75,-5.6; 15 3.25,-5.6; 16 3.75,-5.6; 33 3.75,5.6; 34 3.25,5.6; 35 2.75,5.6; 36 2.25,5.6; 37 1.75,5.6; 38 1.25,5.6; 39 0.75,5.6; 40 0.25,5.6; 41 -0.25,5.6; 42 -0.75,5.6; 43 -1.25,5.6; 44 -1.75,5.6; 45 -2.25,5.6; 46 -2.75,5.6; 47 -3.25,5.6; 48 -3.75,5.6 | smd 1.6 x 0.3: 17 5.6,-3.75; 18 5.6,-3.25; 19 5.6,-2.75; 20 5.6,-2.25; 21 5.6,-1.75; 22 5.6,-1.25; 23 5.6,-0.75; 24 5.6,-0.25; 25 5.6,0.25; 26 5.6,0.75; 27 5.6,1.25; 28 5.6,1.75; 29 5.6,2.25; 30 5.6,2.75; 31 5.6,3.25; 32 5.6,3.75; 49 -5.6,3.75; 50 -5.6,3.25; 51 -5.6,2.75; 52 -5.6,2.25; 53 -5.6,1.75; 54 -5.6,1.25; 55 -5.6,0.75; 56 -5.6,0.25; 57 -5.6,-0.25; 58 -5.6,-0.75; 59 -5.6,-1.25; 60 -5.6,-1.75; 61 -5.6,-2.25; 62 -5.6,-2.75; 63 -5.6,-3.25; 64 -5.6,-3.75
53047-06 = drill 0.5 pad 0.698 long: 1 3.125,0; 2 1.875,0; 3 0.625,0; 4 -0.625,0; 5 -1.875,0; 6 -3.125,0
53047-08 = drill 0.5 pad 0.698 long: 1 4.375,0; 2 3.125,0; 3 1.875,0; 4 0.625,0; 5 -0.625,0; 6 -1.875,0; 7 -3.125,0; 8 -4.375,0
53047-04 = drill 0.5 pad 0.698 long: 1 1.875,0; 2 0.625,0; 3 -0.625,0; 4 -1.875,0
53047-03 = drill 0.5 pad 0.698 long: 1 1.25,0; 2 0,0; 3 -1.25,0
C0603 = smd 1.1 x 1: 1 -0.85,0; 2 0.85,0
A/3216-18R = smd 1.95 x 1.5: + 1.375,0; - -1.375,0
B/3528-21R = smd 1.95 x 2.5: + 1.525,0; - -1.525,0
53047-07 = drill 0.5 pad 0.698 long: 1 3.75,0; 2 2.5,0; 3 1.25,0; 4 0,0; 5 -1.25,0; 6 -2.5,0; 7 -3.75,0
SOD80 = smd 1.4 x 1.8: 1 -1.7,0; 2 1.7,0
SOT223 = smd 1.499 x 2.007: 1 -2.261,-3.15; 2 0.025,-3.15; 3 2.311,-3.15 | smd 3.81 x 2.007: 4 0,3.15
CHIP-LED0805 = smd 1.2 x 1.2: A 0,-1.05; C 0,1.05
SMD5 = smd 2.54 x 5.08: 1 0,0
SC59-BEC = smd 1 x 1.4: B -0.95,-1.2; C 0,1.2; E 0.95,-1.2
R0603 = smd 1 x 1.1: 1 -0.85,0; 2 0.85,0
SJ_2 = smd 1.168 x 1.6: 1 -1.524,0; 2 0,0; 3 1.524,0
TSSOP8 = smd 0.35 x 1.2: 1 -0.975,-2.925; 2 -0.325,-2.925; 3 0.325,-2.925; 4 0.975,-2.925; 5 0.975,2.925; 6 0.325,2.925; 7 -0.325,2.925; 8 -0.975,2.925
GUMDF12 = smd 1.6 x 0.3: 1 -1.8,-7.25; 2 -1.8,-6.75; 3 -1.8,-6.25; 4 -1.8,-5.75; 5 -1.8,-5.25; 6 -1.8,-4.75; 7 -1.8,-4.25; 8 -1.8,-3.75; 9 -1.8,-3.25; 10 -1.8,-2.75; 11 -1.8,-2.25; 12 -1.8,-1.75; 13 -1.8,-1.25; 14 -1.8,-0.75; 15 -1.8,-0.25; 16 -1.8,0.25; 17 -1.8,0.75; 18 -1.8,1.25; 19 -1.8,1.75; 20 -1.8,2.25; 21 -1.8,2.75; 22 -1.8,3.25; 23 -1.8,3.75; 24 -1.8,4.25; 25 -1.8,4.75; 26 -1.8,5.25; 27 -1.8,5.75; 28 -1.8,6.25; 29 -1.8,6.75; 30 -1.8,7.25; 31 1.8,7.25; 32 1.8,6.75; 33 1.8,6.25; 34 1.8,5.75; 35 1.8,5.25; 36 1.8,4.75; 37 1.8,4.25; 38 1.8,3.75; 39 1.8,3.25; 40 1.8,2.75; 41 1.8,2.25; 42 1.8,1.75; 43 1.8,1.25; 44 1.8,0.75; 45 1.8,0.25; 46 1.8,-0.25; 47 1.8,-0.75; 48 1.8,-1.25; 49 1.8,-1.75; 50 1.8,-2.25; 51 1.8,-2.75; 52 1.8,-3.25; 53 1.8,-3.75; 54 1.8,-4.25; 55 1.8,-4.75; 56 1.8,-5.25; 57 1.8,-5.75; 58 1.8,-6.25; 59 1.8,-6.75; 60 1.8,-7.25 | hole 0.61: -1.5,8.3; -1.5,-8.3 | hole 1.422: -12.25,-8; 5.35,9.5
CTS_CRYSTAL = smd 1.2 x 0.9: P$1 -1.85,-1.1; P$2 1.85,-1.1; P$3 1.85,1.1; P$4 -1.85,1.1
53047-05 = drill 0.5 pad 0.698 long: 1 2.5,0; 2 1.25,0; 3 0,0; 4 -1.25,0; 5 -2.5,0

### Placement (x,y rotation side)
AP  54.73,15.2 180 bottom
AP_CON_ANALOG0  64.38,26.51 0 top
AP_CON_ANALOG1  60.07,3.26 180 top
AP_CON_I2C  78.86,3.26 180 top
AP_CON_SERIAL  53.84,26.51 0 top
AUDIO  85.08,20.79 270 top
C1  48.64,22.31 0 top
C2  22.35,14.95 270 bottom
C3  62.86,15.2 90 bottom
C4  54.22,7.07 0 bottom
C5  46.6,11.52 90 bottom
C6  53.21,23.33 180 bottom
C7  13.71,15.08 0 bottom
C8  13.58,17.36 0 bottom
C9  13.84,19.65 0 bottom
C10  66.92,12.15 270 bottom
C11  32.25,23.33 180 bottom
C12  38.6,18.76 270 bottom
C13  10.54,7.96 180 bottom
C14  10.28,5.55 180 bottom
C15  42.03,11.52 0 bottom
C16  42.03,16.85 180 bottom
C17  31.49,7.07 0 bottom
C18  10.41,10.38 180 bottom
C19  42.67,7.84 180 top
C20  46.6,19.27 270 bottom
C21  38.6,11.01 90 bottom
C22  19.05,13.93 270 bottom
C23  65.78,23.08 90 bottom
C24  71.88,21.55 270 bottom
C25  67.81,21.55 270 bottom
C26  66.92,15.2 270 bottom
C27  71.88,16.47 270 bottom
C28  35.43,6.82 180 top
C29  40,9.61 90 top
C30  56.64,22.44 0 top
C31  50.67,20.28 180 top
C32  82.29,11.77 270 bottom
C33  82.29,14.82 90 bottom
CON_GPS  70.73,3.26 180 top
CON_SPI0  48.76,3.26 180 top
CON_SPI1  74.42,26.51 0 top
D1  16.25,3.14 0 bottom
FBW  30.48,15.2 0 bottom
FBW_CON_ANALOG  37.59,26.51 0 top
FBW_CON_I2C  17.52,26.51 0 top
FBW_CON_PWM  26.92,26.51 0 top
FBW_CON_RC  45.08,26.51 0 top
FBW_CON_SERIAL  37.46,3.26 180 top
GUM_CON_SERIAL  85.08,12.03 270 top
IC1  17.39,7.96 90 bottom
IC2  6.6,17.49 270 bottom
LED1  2.54,23.2 180 top
LED2  2.54,19.14 180 top
LED3  81.02,26.63 0 top
LED4  83.18,26.63 0 top
PAD_GND  4.82,9.11 270 bottom
PAD_VIN  4.82,12.41 270 bottom
Q1  24.12,6.82 90 bottom
Q2  60.7,23.33 270 bottom
R1  48.64,24.35 180 top
R2  80.89,6.44 90 bottom
R3  78.35,6.44 90 bottom
R4  16.89,23.46 270 top
R5  18.92,23.46 270 top
R6  42.67,5.8 0 top
R7  14.47,13.04 0 bottom
R8  17.01,13.93 270 bottom
R9  68.32,24.09 0 bottom
R10  69.84,21.55 90 bottom
R11  66.92,18.25 90 bottom
R12  73.15,24.09 180 bottom
R13  82.8,20.41 270 bottom
R14  37.97,6.57 90 top
R15  40,6.57 90 top
R16  32.76,8.85 0 top
R17  53.46,23.46 270 top
R18  51.18,23.46 270 top
R19  56.64,24.47 180 top
R20  85.59,18.12 180 bottom
R21  80.77,20.66 90 bottom
R22  80.26,13.55 270 bottom
R23  5.46,24.22 0 top
R24  5.46,20.16 0 top
R25  78.99,23.71 270 top
R26  85.08,24.22 0 top
R27  48.64,23.33 0 bottom
R28  42.67,5.8 180 bottom
SJ1  63.75,21.3 90 bottom
U$1  69.46,16.47 180 bottom
U$17  76.45,14.19 0 top
U$20  42.03,14.19 180 bottom
X1  10.03,26.51 0 top

### Tracks (layer width: path | path; a pad name or v marks a point on that pad's centre or on a via)
+3V3  (via drill 0.35)
  Top 0.203: R4.2 v16.89,21.55 | R5.2 v18.92,21.55 | v44.57,5.8 R28.2 | v46.73,24.35 R1.2 | R23.2 v7.36,24.22 | R24.2 6.31,21.21 v6.22,21.3 | R25.2 78.82,22.7 v77.97,22.7 | R26.2 85.93,25.2 v85.97,25.23
  Bottom 0.203: FBW.49 34.99,18.95 34.79,18.76 34.79,18.12 34.96,17.95 FBW.51 38.52,17.95 38.6,17.87 | 22.35,14.06 v22.35,13.04 | 33.02,23.33 v34.16,23.33 | 33.02,23.33 C11.2 | FBW.43 31.73,22.04 33.02,23.33 | Q1.E 22.86,7.84 v22.86,9.11 | R3.2 78.52,7.46 80.73,7.46 R2.2 80.93,7.33 81.02,7.33 81.15,7.46 82.8,7.46 v82.93,7.58 | AP.49 50.09,11.45 50.29,11.65 50.29,12.15 49.99,12.45 AP.51 46.65,12.45 46.6,12.41 | U$1.8 67.68,13.55 66.92,12.79 C10.1 66.92,13.04 64.77,13.04 64.77,14.95 v63.88,15.84 63.75,15.96 62.86,15.96 C3.2 62.86,16.09 62.72,15.95 AP.23 | Q2.E 61.97,22.31 v61.97,20.92 | C2.2 22.35,14.06 | FBW.23 22.74,14.45 22.35,14.06 | v29.59,7.07 C17.2 30.73,7.07 30.73,7.71 31.23,8.21 FBW.7 | FBW.63 38.42,11.95 38.6,11.77 C21.2 38.6,12.79 v38.73,12.92 | 38.6,17.87 C12.2 | v39.62,18 38.73,18 38.6,17.87 | AP.7 53.98,23.22 54.1,23.33 | v54.73,24.35 54.35,24.35 54.1,24.09 54.1,23.33 | 54.1,23.33 C6.2 | AP.63 46.68,18.45 46.6,18.38 | 46.6,18.38 C20.2 | v46.6,17.23 46.6,18.38 | v45.59,12.41 46.6,12.41 | 46.6,12.41 C5.2 | AP.43 53.48,7.22 53.34,7.07 | C4.2 53.34,7.07 | 53.34,7.07 v53.34,6.06 | R21.2 80.55,21.51 79.37,22.7 v77.97,22.7 | R27.2 47.11,23.33 46.73,23.71 v46.73,24.35 | R28.2 v44.57,5.8 | R20.2 86.44,20.07 85.72,20.79 AUDIO.2
  Bottom 1.016: IC2.2 11.96,17.46 C8.+ 12.57,17.87 12.57,19.01 12.95,19.39 12.95,19.65 C9.2
  other vias: 12.95,20.79 13.84,21.81 12.57,21.81
  pour Route2 (no thermals): 1.14,1.1 87.24,1.1 87.24,28.79 1.14,28.79
  pour Bottom (no thermals): 13.46,19.14 13.46,20.92 13.58,21.04 14.09,21.04 14.35,21.3 14.35,22.06 13.96,22.44 12.44,22.44 11.93,21.93 11.93,21.04 12.44,20.54 12.44,19.14
+3V7_GUM  (via drill 0.35 pad 0.35)
  Top 0.203: U$17.30 U$17.29 | U$17.28 | U$17.29 U$17.28 | U$17.28 74.67,20.41
  Top 0.813: U$17.29 74.67,20.92 66.03,20.92 61.46,16.34 49.91,16.34 47.11,19.14 35.3,19.14 24.25,8.09 v16.25,8.09
  Bottom 0.406: 14.73,7.99 14.73,8.09 | 14.73,7.99 IC1.2 | 14.73,7.96 14.73,7.99 | 12.06,8.09 C13.+
  Bottom 0.813: C13.+ 14.73,7.96 | C14.2 12.06,5.55 C13.+ | 14.73,8.09 v16.25,8.09
ADC1_2
  Bottom 0.203: AP.35 57.48,7.88 59.94,5.42 62.61,5.42 64.44,3.59 AP_CON_ANALOG1.8
ADC1_3
  Bottom 0.203: AP.38 55.98,8.75 59.69,5.04 61.84,5.04 63.19,3.7 AP_CON_ANALOG1.7
ADC1_4
  Bottom 0.203: AP.39 55.48,8.48 59.3,4.66 60.95,4.66 61.97,3.65 61.94,3.62 AP_CON_ANALOG1.6
ADC1_5
  Bottom 0.203: AP.45 52.48,6.02 53.84,4.66 57.4,4.66 58.19,3.87 AP_CON_ANALOG1.3
ADC1_6  (via drill 0.35)
  Top 0.203: v55.24,11.14 55.24,7.84 59.44,3.63 AP_CON_ANALOG1.4
  Bottom 0.203: AP.1 50.98,19.84 54.99,15.84 54.99,11.39 v55.24,11.14
ADC1_7  (via drill 0.35)
  Top 0.203: v56.26,11.14 56.26,8.22 60.7,3.77 60.69,3.76 AP_CON_ANALOG1.5
  Bottom 0.203: AP.2 51.48,19.85 55.49,15.84 55.49,11.9 v56.26,11.14
AP_ADC0_1  (via drill 0.35)
  Top 0.203: v56.76,19.52 56.76,20.16 57.27,20.66 58.29,20.66 62.51,24.88 AP_CON_ANALOG0.5
  Bottom 0.203: AP.13 56.98,19.74 v56.76,19.52
AP_ADC0_2  (via drill 0.35)
  Top 0.203: v57.4,18.76 57.4,19.9 57.65,20.16 58.41,20.16 63.75,25.49 63.75,26.51 AP_CON_ANALOG0.4
  Bottom 0.203: AP.14 57.4,20.72 v57.4,18.76
AP_ADC0_3  (via drill 0.35)
  Top 0.203: v58.03,19.52 58.41,19.52 65.02,26.12 AP_CON_ANALOG0.3
  Bottom 0.203: AP.15 57.98,19.57 v58.03,19.52
AP_AUDIO  (via drill 0.35)
  Top 0.203: AP_CON_ANALOG0.6 61.21,26.51 61.21,24.35 58.03,21.17 56.89,21.17 v55.24,19.52
  Bottom 0.203: AP_CON_ANALOG0.6 61.21,26.51 61.21,26 62.1,25.11 62.73,25.11 63.75,24.09 SJ1.3 | AP.9 54.98,19.78 v55.24,19.52
AP_I2C_SCL
  Bottom 0.203: AP_CON_I2C.4 80.74,5.52 80.81,5.59 R2.1 80.3,6.19 79.37,6.19 79.12,6.44 77.72,6.44 76.19,7.96 70.99,7.96 70.1,8.85 60.7,8.85 58.54,11.01 58.54,15.71 59.28,16.45 AP.22
AP_I2C_SDA  (via drill 0.35)
  Top 0.203: v71.5,8.6 v71.5,7.33
  Bottom 0.203: AP_CON_I2C.3 79.49,4.42 78.35,5.55 R3.1 77.81,5.59 76.07,7.33 v71.5,7.33 | AP.26 59.44,14.45 59.05,14.06 59.05,11.27 61.08,9.23 70.86,9.23 v71.5,8.6
AP_P0.14
  Bottom 0.203: AP.41 54.48,15.83 50.54,19.77 50.54,23.33 | 50.54,23.33 50.54,25.62 50.67,25.74 50.67,26.51 AP_CON_SERIAL.7 | 50.54,23.33 R27.1
AP_RESET  (via drill 0.35)
  Top 0.203: AP_CON_SERIAL.8 49.52,26.51 49.49,26.47 R1.1 49.49,22.35 49.52,22.31 | 49.52,22.31 C1.2 | v49.52,21.3 49.52,22.31
  Bottom 0.203: AP.57 50.16,15.45 50.41,15.71 50.41,19.27 50.16,19.52 50.16,20.66 v49.52,21.3
AP_RXD0  (via drill 0.35)
  Top 0.203: v75.94,15.08 75.81,14.95 75.81,13.81 76.68,12.94 U$17.48
  Bottom 0.203: AP_CON_SERIAL.4 54.47,26.13 58.92,21.68 58.92,19.77 58.8,19.65 58.8,17.23 59.08,16.95 AP.21 63.52,16.95 64,16.47 64.51,16.47 64.89,16.85 64.89,17.87 65.27,18.25 68.96,18.25 70.73,16.47 72.64,16.47 74.04,15.08 v75.94,15.08
AP_RXD1  (via drill 0.35)
  Top 0.203: CON_GPS.4 71.36,3.76 71.37,3.77 67.05,8.09 v58.16,8.09
  Bottom 0.203: AP.34 57.98,8.27 v58.16,8.09
AP_TXD0  (via drill 0.35)
  Top 0.203: v64.26,17.11 64.28,17.11 68.96,12.44 68.96,12.41 72.51,12.41 72.64,12.54 73.53,12.54 73.63,12.44 U$17.12
  Bottom 0.203: AP_CON_SERIAL.3 55.75,26.51 55.75,25.49 59.3,21.93 59.3,19.52 59.18,19.39 59.18,18.12 59.35,17.95 AP.19 63.41,17.95 v64.26,17.11
AP_TXD1
  Bottom 0.203: CON_GPS.3 70.11,3.76 65.78,8.09 59.05,8.09 58.48,8.66 AP.33
AP_USB+
  Top 0.203: 53.22,24.48 53.21,24.47 53.21,24.35 53.42,24.35 R17.1 53.46,24.35 53.22,24.35 AP_CON_SERIAL.5
AP_USB-
  Top 0.203: AP_CON_SERIAL.6 51.97,25.39 51.18,24.6 R18.1
AP_USB_CONNECT
  Bottom 0.203: AP.17 60.33,22.33 60.7,22.7 60.7,23.46 61.46,24.22 61.84,24.22 Q2.B
AP_USB_N  (via drill 0.35)
  Top 0.203: v56,19.01 55.88,18.88 54.73,18.88 53.34,20.28 C31.1 51.43,20.28 51.43,22.35 R18.2
  Bottom 0.203: AP.11 55.98,19.03 v56,19.01
AP_USB_P  (via drill 0.35)
  Top 0.203: R17.2 53.46,22.57 53.84,22.19 v54.73,22.19 55.49,22.19 55.75,22.44 | 55.75,22.44 C30.1 | R19.2 55.79,22.48 55.75,22.44
  Bottom 0.203: AP.10 55.48,21.69 54.99,22.19 v54.73,22.19
FBW_AD0
  Bottom 0.203: FBW.45 32.73,21.77 33.27,22.31 34.54,22.31 38.22,26 38.21,26.01 FBW_CON_ANALOG.3
FBW_AD1
  Bottom 0.203: FBW.39 29.73,23.98 30.09,24.35 35.3,24.35 36.96,26.01 FBW_CON_ANALOG.4
FBW_AD2
  Bottom 0.203: FBW.38 29.23,24.37 29.59,24.73 34.41,24.73 35.68,26 35.68,26.51 FBW_CON_ANALOG.5
FBW_AD3
  Bottom 0.203: FBW.35 27.73,23.88 28.95,25.11 33.02,25.11 34.41,26.51 FBW_CON_ANALOG.6
FBW_AUDIO  (via drill 0.35)
  Top 0.203: v62.48,19.77 62.48,18.5 61.08,17.11 50.29,17.11 47.49,19.9 34.54,19.9 v28.82,14.19
  Bottom 0.203: FBW.9 30.23,10.51 30.6,10.88 30.6,12.41 v28.82,14.19 | v62.48,19.77 SJ1.1
FBW_I2C_SCL  (via drill 0.35)
  Top 0.203: v23.49,13.81 22.86,14.44 22.86,17.87 19.81,20.92 18.54,20.92 17.78,21.68 17.78,23.71 17.14,24.35 16.89,24.35 R4.1 16.89,24.73 15.65,25.97 FBW_CON_I2C.4
  Bottom 0.203: FBW.22 23.64,13.95 v23.49,13.81
FBW_I2C_SDA  (via drill 0.35)
  Top 0.203: v23.49,16.09 23.49,18.12 19.81,21.81 19.81,23.58 19.08,24.31 R5.1 18.92,24.35 18.54,24.35 16.9,25.99 FBW_CON_I2C.3
  Bottom 0.203: FBW.26 23.63,15.95 v23.49,16.09
FBW_P0.14
  Bottom 0.203: FBW.41 30.73,19.91 30.98,19.65 33.52,19.65 34.41,18.76 34.41,10.88 36.44,8.85 40.25,8.85 40.63,8.47 40.63,5.8 | FBW_CON_SERIAL.7 40.63,3.26 40.63,5.8 | 40.63,5.8 R28.1
FBW_PPM_IN  (via drill 0.35)
  Top 0.203: v20.32,18.88 18.66,18.88 12.44,25.11 10.92,25.11 10.03,26 X1.3
  Bottom 0.203: FBW.30 24.04,17.95 23.74,18.25 22.22,18.25 21.59,18.88 v20.32,18.88
FBW_PWM1  (via drill 0.35)
  Top 0.203: v27.81,16.85 27.81,24.98 28.79,25.97 FBW_CON_PWM.3
  Bottom 0.203: FBW.1 34.23,10.44 v27.81,16.85
FBW_PWM2  (via drill 0.35)
  Top 0.203: v26.92,13.81 26.92,25.23 27.55,25.87 27.54,25.87 FBW_CON_PWM.4
  Bottom 0.203: FBW.21 26.51,13.45 26.54,13.42 | 26.54,13.42 26.92,13.04 26.92,11.39 26.28,10.76 26.28,8.6 28.7,6.19 34.41,6.19 36.84,3.76 FBW_CON_SERIAL.4 | 26.54,13.42 v26.92,13.81
FBW_PWM3  (via drill 0.35)
  Top 0.203: FBW_CON_PWM.5 v26.29,12.79 v26.28,12.79
  Bottom 0.203: FBW.19 25.86,12.45 25.9,12.41 | 25.9,12.41 26.03,12.28 26.03,11.14 25.9,11.01 25.9,8.34 28.57,5.68 34.16,5.68 35.55,4.28 35.55,3.26 FBW_CON_SERIAL.3 | 25.9,12.41 v26.28,12.79
FBW_PWM4
  Bottom 0.203: FBW.34 27.23,21.63 25.14,23.71 25.04,23.81 FBW_CON_PWM.6
FBW_PWM5
  Bottom 0.203: FBW.33 26.73,21.49 23.79,24.42 FBW_CON_PWM.7
FBW_PWM6
  Bottom 0.203: FBW.31 25.85,18.45 26.03,18.63 26.03,21.55 22.6,24.98 22.54,25.04 FBW_CON_PWM.8
FBW_RC_RX
  Bottom 0.203: FBW.46 33.23,21.76 33.4,21.93 39.62,21.93 43.83,26.14 FBW_CON_RC.3
FBW_RESET  (via drill 0.35)
  Top 0.203: 41.78,5.8 41.82,5.84 41.78,5.88 41.78,7.84 | 41.78,5.8 R6.1 | FBW_CON_SERIAL.8 41.84,5.75 41.78,5.8 | 41.78,7.84 v41.78,8.85 | 41.78,7.84 C19.2
  Bottom 0.203: FBW.57 35.05,14.95 34.79,14.69 34.79,11.14 36.7,9.23 41.4,9.23 v41.78,8.85
FBW_SERVO_CLK  (via drill 0.35)
  Top 0.203: v20.95,18.12 18.92,18.12 12.31,24.73 10.03,24.73 8.78,25.98 X1.4
  Bottom 0.203: FBW.29 24.03,17.45 23.74,17.74 22.09,17.74 21.71,18.12 v20.95,18.12
FBW_SERVO_RESET  (via drill 0.35)
  Top 0.203: v21.59,17.36 19.17,17.36 12.19,24.35 9.14,24.35 7.53,25.96 X1.5
  Bottom 0.203: FBW.28 24.03,16.95 23.74,17.23 21.71,17.23 v21.59,17.36
FBW_USB+
  Top 0.203: 37.97,5.8 R14.1 37.97,5.68 38.09,5.56 FBW_CON_SERIAL.5
FBW_USB-
  Top 0.203: R15.1 40,5.68 39.34,5.01 FBW_CON_SERIAL.6
FBW_USB_CONNECT
  Bottom 0.203: FBW.17 24.82,11.45 24.63,11.27 24.63,9.74 24.63,8.09 24.12,7.58 24.12,6.95 22.98,5.8 Q1.B
FBW_USB_N  (via drill 0.35)
  Top 0.203: v29.84,12.03 33.14,12.03 36.57,8.6 39.87,8.6 40,8.72 C29.1 R15.2
  Bottom 0.203: FBW.11 29.23,11.41 v29.84,12.03
FBW_USB_P  (via drill 0.35)
  Top 0.203: 37.97,7.2 37.93,7.24 | 35.43,8.85 33.27,11.01 v29.84,11.01 | 35.43,8.85 36.28,8 C28.1 36.66,7.2 37.97,7.2 | 35.43,8.85 R16.2 | 37.97,7.2 R14.2
  Bottom 0.203: FBW.10 29.71,10.88 v29.84,11.01
FOO_BAR
  Bottom 0.203: SJ1.2 64.77,21.3 65.78,22.31 C23.1 65.82,22.23 67.47,23.88 R9.2
GND  (via drill 0.35, 0.35 pad 0.35)
  Top 0.203: C19.1 v44.57,7.84 | v46.73,22.31 C1.1 47.79,21.89 49.4,20.28 C31.2 | U$17.60 79.51,6.94 v79.62,6.82 | U$17.7 73.6,9.94 v73.15,9.49 | U$17.1 73.14,6.94 v72.89,6.69 | U$17.42 79.34,15.94 v79.62,16.22 | C28.2 34.54,6.82 34.29,7.07 v33.4,7.07 | C29.2 40,10.5 39.62,10.12 v37.46,10.12 | C30.2 57.91,22.44 v60.32,24.85
  Top 0.254: U$17.31 v79.61,21.44 v79.62,21.42
  Bottom 0.203: FBW.50 37.28,18.45 38.6,19.77 38.6,19.65 | FBW.59 37.1,13.95 v37.59,14.44 | C16.2 42.79,16.94 v42.79,18.12 | v40.13,11.52 C15.2 | 31.24,23.33 v30.35,23.33 | v33.4,7.07 C17.1 32.25,7.07 32.25,7.71 31.73,8.24 FBW.6 | FBW.18 23.92,11.95 v22.98,11.01 | 31.24,23.33 C11.1 | FBW.42 31.23,23.32 31.24,23.33 | AP.59 47.73,16.45 v47.62,16.34 | C20.1 v46.6,21.17 | AP.42 53.98,8.46 55.11,7.33 55.11,7.07 | AP.18 61.16,18.45 v61.72,19.01 | C23.2 v65.78,24.98 | U$1.4 70.86,19.4 v71.11,19.65 71.88,20.41 C24.2 | C10.2 66.92,10.5 v66.67,10.25 | C26.2 66.92,14.31 v65.53,14.31 | AUDIO.1 85.08,19.52 82.84,19.52 R13.2 | FBW.25 22.73,15.45 22.35,15.84 | 22.35,15.84 C2.1 | 22.35,15.84 v21.33,15.84 | C21.1 38.6,10.12 v37.46,10.12 | v40.63,18 38.98,19.65 38.6,19.65 | 38.6,19.65 C12.1 | AP.6 53.48,22.17 52.32,23.33 | 52.32,23.33 C6.1 | 52.32,23.33 v52.32,24.35 | v45.59,10.63 46.6,10.63 | 46.6,10.63 C5.1 | AP.50 47.93,11.95 46.6,10.63 | C4.1 55.11,7.07 | 55.11,7.07 v55.11,6.06 | AP.25 62.22,14.95 62.86,14.31 C3.1 62.86,14.44 v64,14.44 | C33.2 82.29,16.6 v82.42,16.73 | v82.04,9.87 82.29,10.12 C32.2
  other vias: 2.79,7.33 3.93,7.33 5.08,7.33 6.22,7.33 10.41,21.17 9.27,21.17 8.12,21.17 16.63,16.47 16.63,17.62 16.63,18.88 15.74,19.77 8,19.9 19.05,4.53 17.78,4.53
  pour Route15 (no thermals): 1.14,1.1 87.24,1.1 87.24,28.79 1.14,28.79
  pour Bottom (no thermals): 2.28,10.38 2.28,7.07 2.66,6.69 8.25,6.69 8.89,6.06 8.89,5.17 9.14,4.92 9.9,4.92 9.9,11.01 8,11.01 7.36,10.38
  pour Bottom (no thermals): 14.22,14.31 19.55,14.31 19.55,15.33 17.52,17.36 17.52,19.27 16.38,20.41 14.22,20.41
  pour Bottom (no thermals): 10.66,19.01 7.74,19.01 7.23,19.52 7.23,21.42 7.74,21.93 10.66,21.93 11.04,21.55 11.04,19.39
  pour Bottom (no thermals): 17.27,2.38 19.55,2.38 19.55,4.92 17.27,4.92
GUM_HW_RXD
  Top 0.203: U$17.33 79.34,20.44 79.75,20.03 79.75,19.39 81.27,17.87 81.27,6.69 79.12,4.53 76.58,4.53 75.31,3.26 CON_GPS.6
GUM_HW_TXD
  Top 0.203: U$17.35 79.07,19.44 80.77,17.74 80.77,6.82 78.99,5.04 76.32,5.04 75.81,4.53 73.4,4.53 72.64,3.77 72.64,3.26 CON_GPS.5
GUM_SCL  (via drill 0.35)
  Top 0.203: U$17.20 75.52,16.44 v76.83,17.74
  Bottom 0.203: GUM_CON_SERIAL.8 84.52,16.4 83.05,17.87 82.29,17.87 | v76.83,17.74 76.96,17.87 82.29,17.87 | 82.29,17.87 82.29,18.63 81.78,19.14 81.11,19.81 R21.1
GUM_SDA  (via drill 0.35)
  Top 0.203: U$17.19 76.04,15.94 v76.83,16.73
  Bottom 0.203: 85.08,15.2 84.45,15.2 83.43,16.22 83.43,16.6 82.67,17.36 77.46,17.36 v76.83,16.73 | R20.1 84.74,17.83 85.34,17.23 86.1,17.23 86.48,16.85 86.48,15.96 85.72,15.2 85.08,15.2 | 85.08,15.2 GUM_CON_SERIAL.7
GUM_USB+  (via drill 0.35)
  Top 0.203: U$17.11 75.65,11.94 v76.07,11.52
  Bottom 0.203: v76.07,11.52 77.85,11.52 78.99,12.66 80.26,12.66 R22.2 82.25,12.7 82.29,12.66 | 82.29,12.66 C32.1 | GUM_CON_SERIAL.5 82.3,12.65 82.29,12.66
GUM_USB-  (via drill 0.35)
  Top 0.203: U$17.59 77.23,7.44 77.08,7.58 77.08,11.9 v76.7,12.28
  Bottom 0.203: 82.16,13.93 81.4,13.93 81.02,13.55 77.97,13.55 v76.7,12.28 | 82.16,13.93 82.29,13.93 C33.1 82.2,13.97 82.16,13.93 | GUM_CON_SERIAL.6 82.19,13.9 82.16,13.93
GUM_USB_CONNECT  (via drill 0.35)
  Top 0.203: U$17.39 79.55,17.44 80.39,16.6 80.39,15.71 v80.13,15.46
  Bottom 0.203: R22.1 80.26,14.31 80.13,14.44 v80.13,15.46
GUM_XRXD  (via drill 0.35)
  Top 0.203: U$17.54 79.3,9.94 v79.75,9.49
  Bottom 0.203: GUM_CON_SERIAL.4 85.08,11.39 84.58,11.39 82.42,9.23 80,9.23 v79.75,9.49
GUM_XTXD  (via drill 0.35)
  Top 0.203: U$17.26 75.9,19.44 v75.94,19.39 | v81.53,18.5 81.78,18.25 81.78,12.92 84.58,10.12 85.08,10.12 GUM_CON_SERIAL.3
  Bottom 0.203: v75.94,19.39 76.83,18.5 v81.53,18.5
LED1  (via drill 0.35)
  Top 0.203: v19.17,16.6 17.52,18.25 14.47,18.25 10.57,22.15 LED1.C
  Bottom 0.203: FBW.32 22.28,18.95 21.59,19.65 19.68,19.65 19.17,19.14 v19.17,16.6
LED2  (via drill 0.35)
  Top 0.203: LED2.C 13.87,18.09 19.93,12.03 v22.35,12.03
  Bottom 0.203: FBW.20 23.27,12.95 v22.35,12.03
LED3  (via drill 0.35)
  Top 0.203: v55.24,18.25 55.49,18 57.53,18 63.62,24.09 66.8,24.09 68.57,25.87 68.57,26.76 70.1,28.28 78.73,28.28 79.37,27.65 81.02,27.65 LED3.C
  Bottom 0.203: AP.8 54.48,19.13 54.48,19.14 54.48,19.01 v55.24,18.25
LED4  (via drill 0.35)
  Top 0.203: v53.97,18.38 54.73,17.62 57.78,17.62 63.88,23.71 67.05,23.71 69.08,25.74 69.08,26.63 70.35,27.9 78.48,27.9 79.75,26.63 82.04,26.63 83.18,27.77 LED4.C
  Bottom 0.203: AP.4 52.48,19.87 v53.97,18.38
LPC_CLOCK
  Bottom 0.203: FBW.61 36.99,12.95 39.37,15.33 40.25,15.33 40.21,15.29 U$20.P$1 41,16.11 | C16.1 41.14,16.85 41.14,16.25 41,16.11 | AP.62 48.21,17.95 46.35,16.09 41.02,16.09 41,16.11
N$1
  Bottom 0.203: 43.88,13.12 43.94,13.17 | 43.88,13.12 U$20.P$3 43.88,13.1 42.92,14.06 38.73,14.06 37.12,12.45 FBW.62 | C15.1 42.88,12.12 43.88,13.12
N$2
  Bottom 0.813: IC1.1 14.24,3.14 D1.2
N$3
  Top 0.203: R26.1 84.2,24.22 83.18,25.23 LED4.A
N$4
  Top 0.203: R23.1 4.57,24.22 4.53,24.25 LED1.A
N$5
  Top 0.203: R24.1 4.57,20.16 4.53,20.19 LED2.A
N$6
  Top 0.203: LED3.A 81.02,25.62 80.04,25.62 R25.1
N$13
  Bottom 0.203: R10.2 69.76,22.4 69.72,22.44 69.68,22.4 68.83,22.4 | C25.1 68.83,22.4 | R9.1 68.83,23.75 68.83,22.4
N$15
  Bottom 0.203: C24.1 71.88,22.57 70.01,20.7 R10.1 69.84,20.66 69.79,20.61 U$1.3
N$17
  Bottom 0.203: U$1.2 69.09,19.4 69.08,19.39 69.08,19.4 U$1.1 | C25.2 67.81,20.66 68.49,19.99 U$1.1 | U$1.1 67.22,19.39 R11.2
N$18
  Bottom 0.203: R11.1 C26.1 69.12,16.05 70.44,14.74 U$1.5
N$19
  Bottom 0.203: U$1.7 69.71,13.55 69.72,13.55 U$1.6 69.79,12.97 70.23,12.54 70.61,12.54 71.88,13.81 C27.+
N$20
  Bottom 0.203: C27.- 71.88,17.87 72.77,18.76 72.77,23.2 72.38,23.58 72.38,24.09 R12.1 72.26,24.09
N$21
  Bottom 0.203: AUDIO.3 85.08,22.06 84.58,22.06 83.78,21.26 R13.1 82.8,21.17 81.66,22.31 80.51,22.31 78.73,24.09 R12.2
N$24  (via drill 0.35)
  Top 0.203: v26.54,6.82 28.57,8.85 R16.1
  Bottom 0.203: Q1.C v26.54,6.82
N$27  (via drill 0.35)
  Top 0.203: R19.1 58.54,24.47 v58.92,24.85
  Bottom 0.203: Q2.C 59.56,23.33 59.56,24.22 v58.92,24.85
SPI0_IT
  Bottom 0.203: AP.46 51.98,5.89 52.51,5.36 CON_SPI0.7
SPI0_MISO  (via drill 0.35)
  Top 0.203: v39.24,16.73 44.32,16.73 v47.75,13.3 48.76,12.28 CON_SPI0.4
  Bottom 0.203: FBW.53 39.01,16.95 v39.24,16.73 | AP.53 47.9,13.45 v47.75,13.3
SPI0_MOSI  (via drill 0.35)
  Top 0.203: v38.35,16.09 43.94,16.09 v46.35,13.68 47.51,12.52 CON_SPI0.3
  Bottom 0.203: FBW.54 37.99,16.45 v38.35,16.09 | AP.54 46.62,13.95 v46.35,13.68
SPI0_SCK  (via drill 0.35)
  Top 0.203: 50.03,12.03 50.67,11.39 v51.43,11.39 | CON_SPI0.5 50.01,12.01 50.03,12.03 | v41.65,18.12 42.29,17.49 44.57,17.49 50.03,12.03
  Bottom 0.203: FBW.47 33.73,19.95 34.16,19.52 36.95,19.52 37.97,20.54 39.24,20.54 v41.65,18.12 | AP.47 51.48,11.39 v51.43,11.39
SPI0_SS  (via drill 0.35)
  Top 0.203: v37.59,15.46 43.56,15.46 v44.95,14.06
  Bottom 0.203: FBW.55 37.09,15.95 v37.59,15.46 | AP.55 45.35,14.45 v44.95,14.06
SPI0_SS1
  Bottom 0.203: AP.48 50.98,5.74 51.26,5.46 CON_SPI0.6
SPI1_MISO  (via drill 0.35)
  Top 0.203: v63.11,12.54 66.67,12.54 67.81,11.39 72.38,11.39 v73.15,10.63 | CON_SPI1.4 74.42,25.74 76.32,23.84 76.32,21.68 v75.94,21.3 | v76.96,13.55 76.96,14.06 77.33,14.44 U$17.45
  Bottom 0.203: AP.29 61.68,12.95 62.1,12.54 v63.11,12.54 | v75.94,21.3 75.31,20.66 75.31,17.23 77.08,15.46 77.08,13.68 v76.96,13.55 74.04,10.63 v73.15,10.63
SPI1_MOSI  (via drill 0.35)
  Top 0.203: v62.23,11.77 66.8,11.77 67.81,10.76 v70.99,10.76 | v72.38,13.55 72.38,16.6 73.72,17.94 U$17.23 75.5,17.94 76.7,19.14 76.7,24.09 75.67,25.13 CON_SPI1.3
  Bottom 0.203: AP.30 61.55,12.45 v62.23,11.77 | v70.99,10.76 72.38,12.15 v72.38,13.55
SPI1_SCK  (via drill 0.35)
  Top 0.203: v62.35,13.17 66.67,13.17 67.94,11.9 v73.02,11.9 | v73.15,14.06 73.15,16.34 73.74,16.94 U$17.21 75.52,16.94 75.81,17.23 75.81,17.62 77.08,18.88 v77.08,24.85
  Bottom 0.203: AP.27 61.57,13.95 v62.35,13.17 | v73.02,11.9 73.15,12.03 v73.15,14.06 | CON_SPI1.5 73.17,25.98 74.04,25.11 76.83,25.11 v77.08,24.85
SPI1_SS  (via drill 0.35)
  Top 0.203: v62.86,11.01 66.92,11.01 67.81,10.12 v71.75,10.12 | U$17.44 77.07,14.94 v76.45,14.31
  Bottom 0.203: AP.31 61.16,11.95 62.1,11.01 v62.86,11.01 | v71.75,10.12 72.89,11.27 73.4,11.27 v76.45,14.31 76.58,14.44 76.58,15.33 73.15,18.76 73.15,24.85 71.92,26.08 CON_SPI1.6
VBAT_IN
  Bottom 0.203: 12.19,13.04 R7.2
  Bottom 1.016: 12.19,15.08 C7.+ | PAD_VIN.1 11.81,12.41 | 11.81,12.41 12.19,12.41 12.19,13.04 12.19,15.08 | IC2.3 9.77,15.18 9.77,15.08 12.19,15.08 | 11.81,10.38 C18.+ | 11.81,12.41 11.81,10.38 | 14.22,10.27 14.22,10.25 | 14.22,10.27 IC1.3 | 11.81,10.38 14.22,10.38 14.22,10.27
VBAT_MEAS
  Bottom 0.203: R7.1 17.01,13.04 R8.2 17.05,13.04 19.05,13.04 | FBW.27 24.02,16.45 23.74,16.73 21.33,16.73 20.57,15.96 20.57,14.06 19.55,13.04 19.05,13.04 | 19.05,13.17 C22.2 19.05,13.04

### Text on the board
tDocu: FBW RC0 | FBW I2C | FBW PWM | FBW ANALOG | FBW RC1 | AP SERIAL | AP ANALOG 0 | SPI 1 | AUDIO | GUMSTIX SERIAL | Paparazzi Classix V0.99 | by Poine | FBW SERIAL | SPI 0 | AP ANALOG 1 | GPS SERIAL | AP I2C